# EAGLE board 1203_054 (EAGLE 7.1.0), part 1 of 3
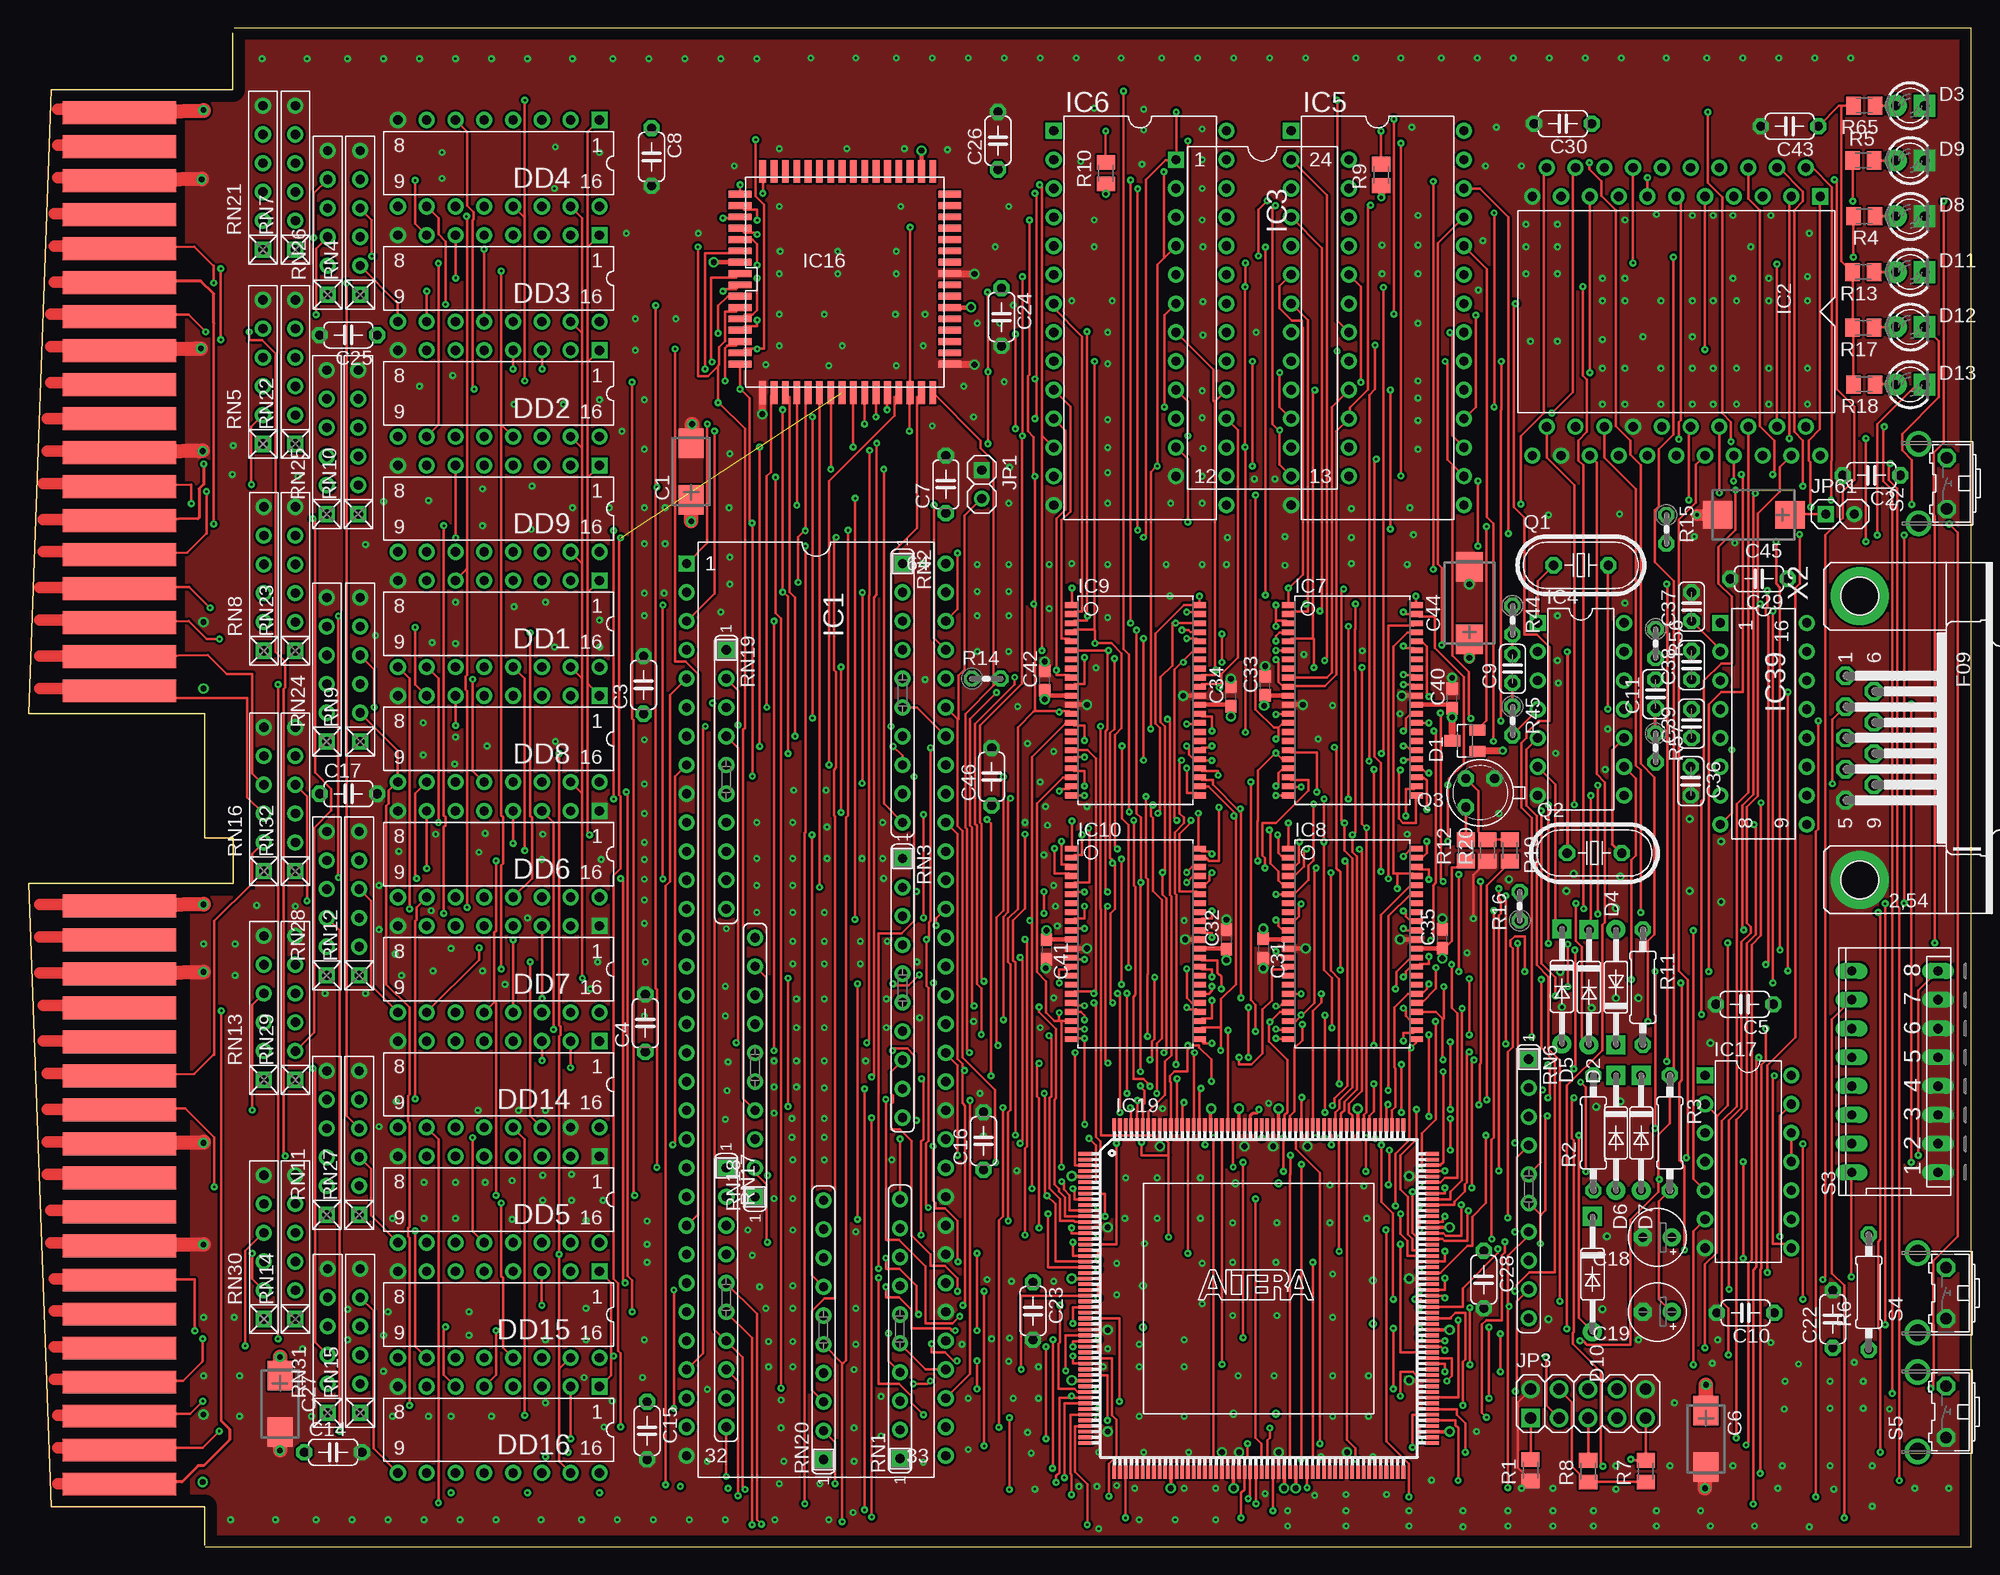
[diagram p3: board, top side]
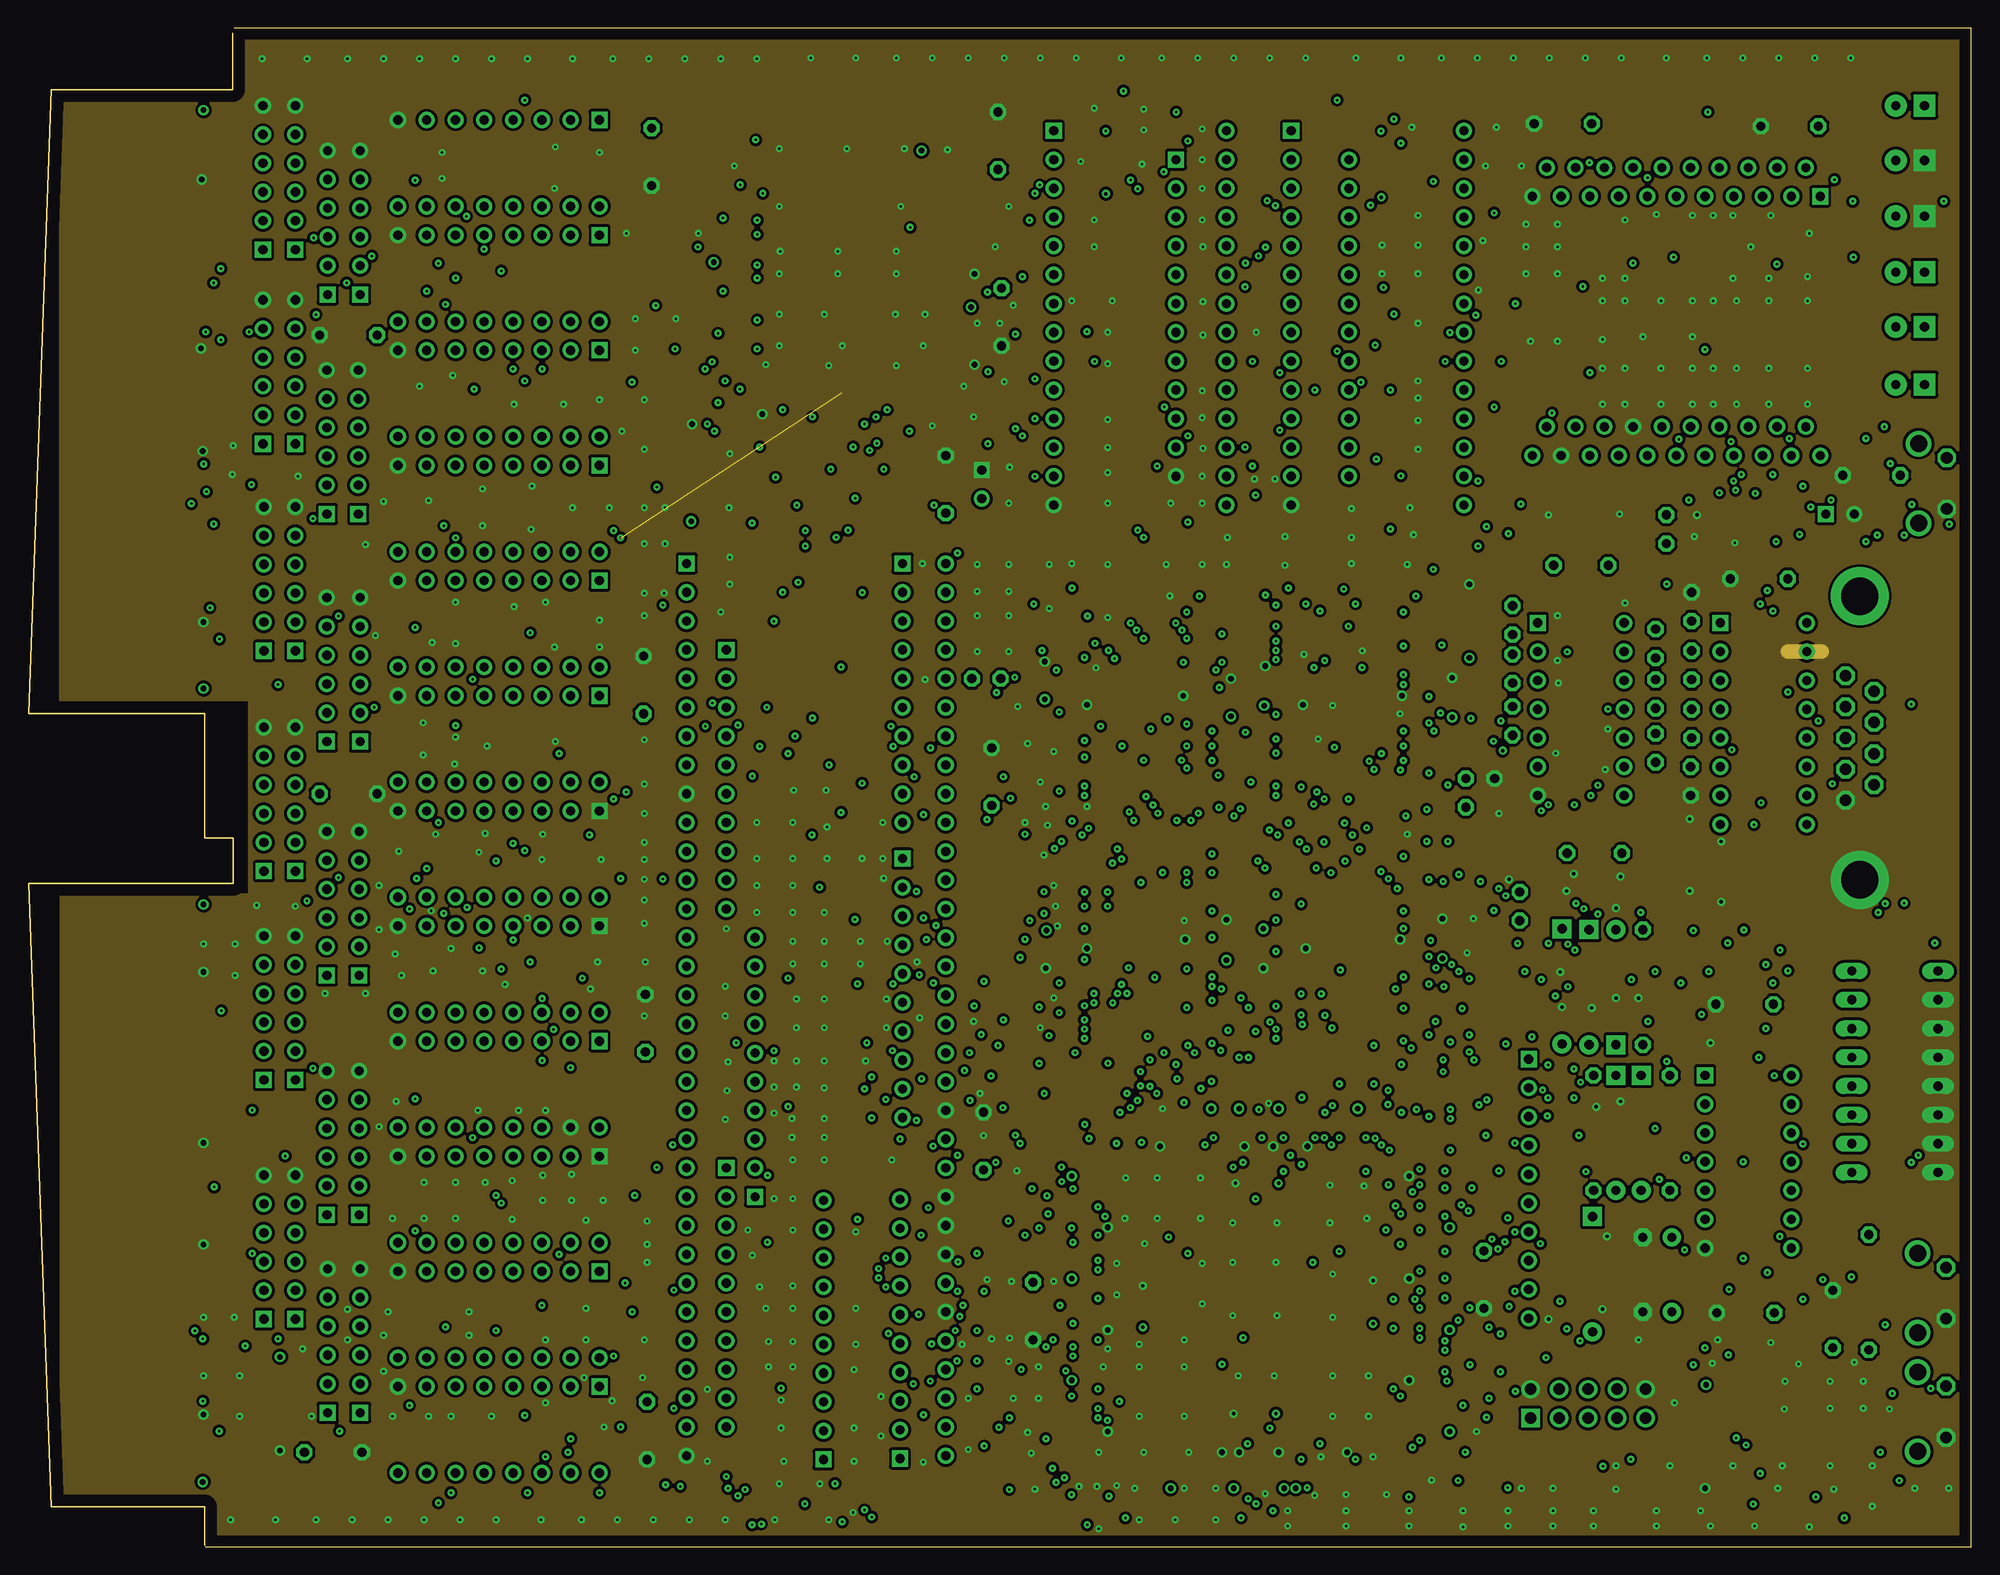
[diagram p4: board, inner layer Route2]
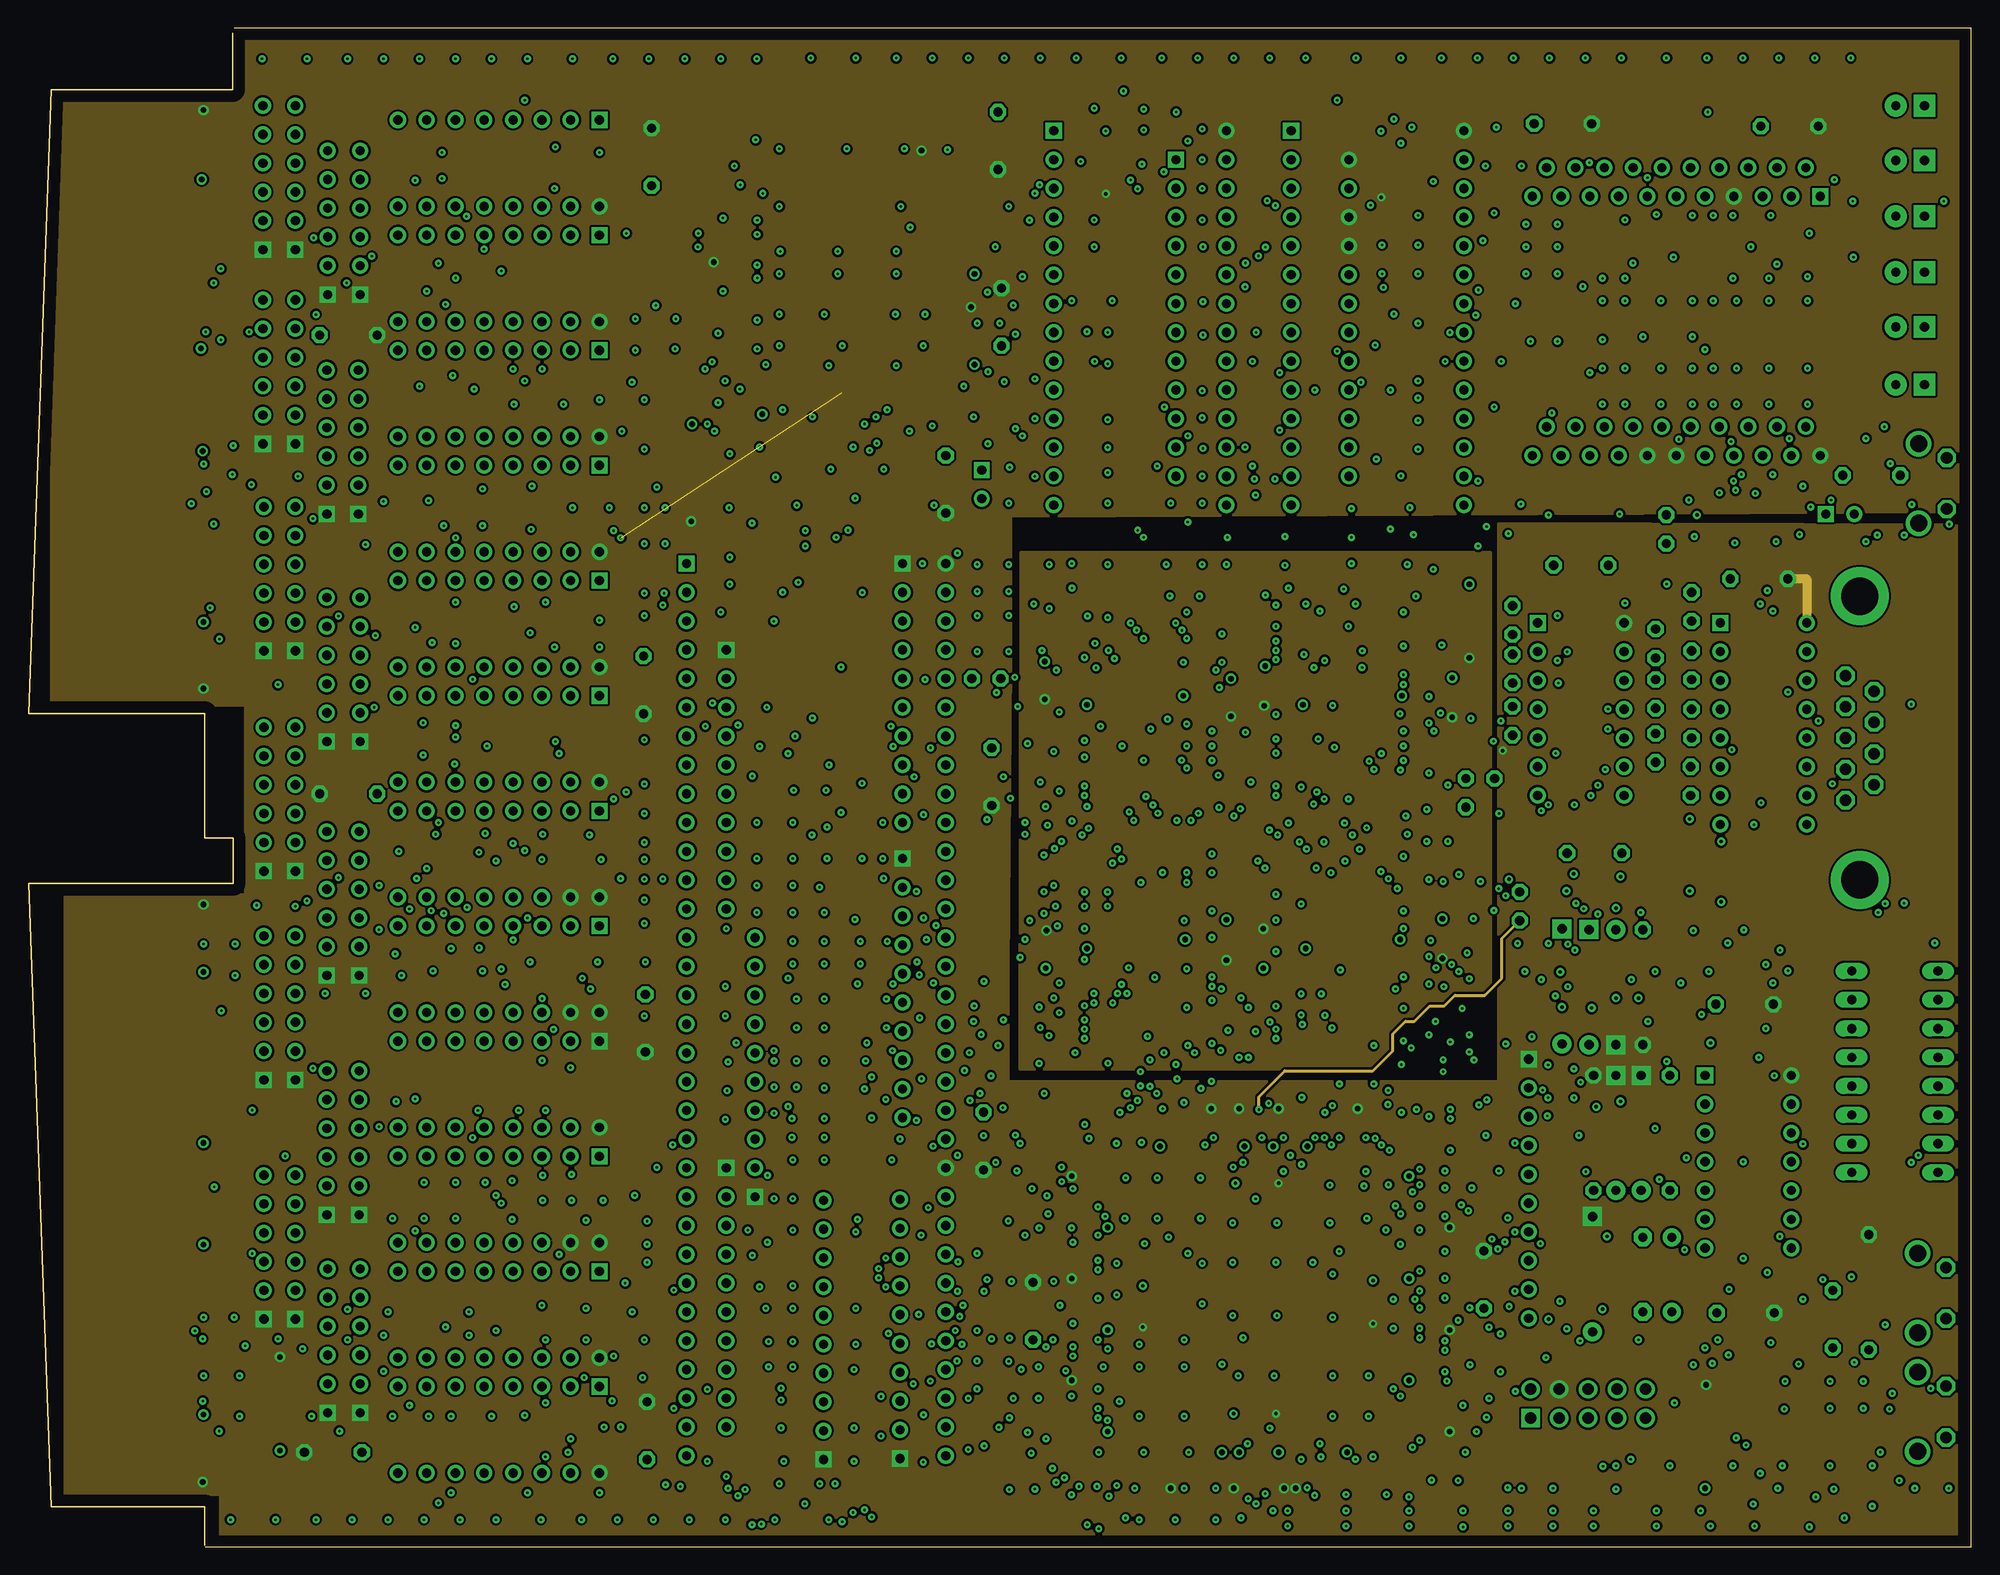
[diagram p5: board, inner layer Route3]
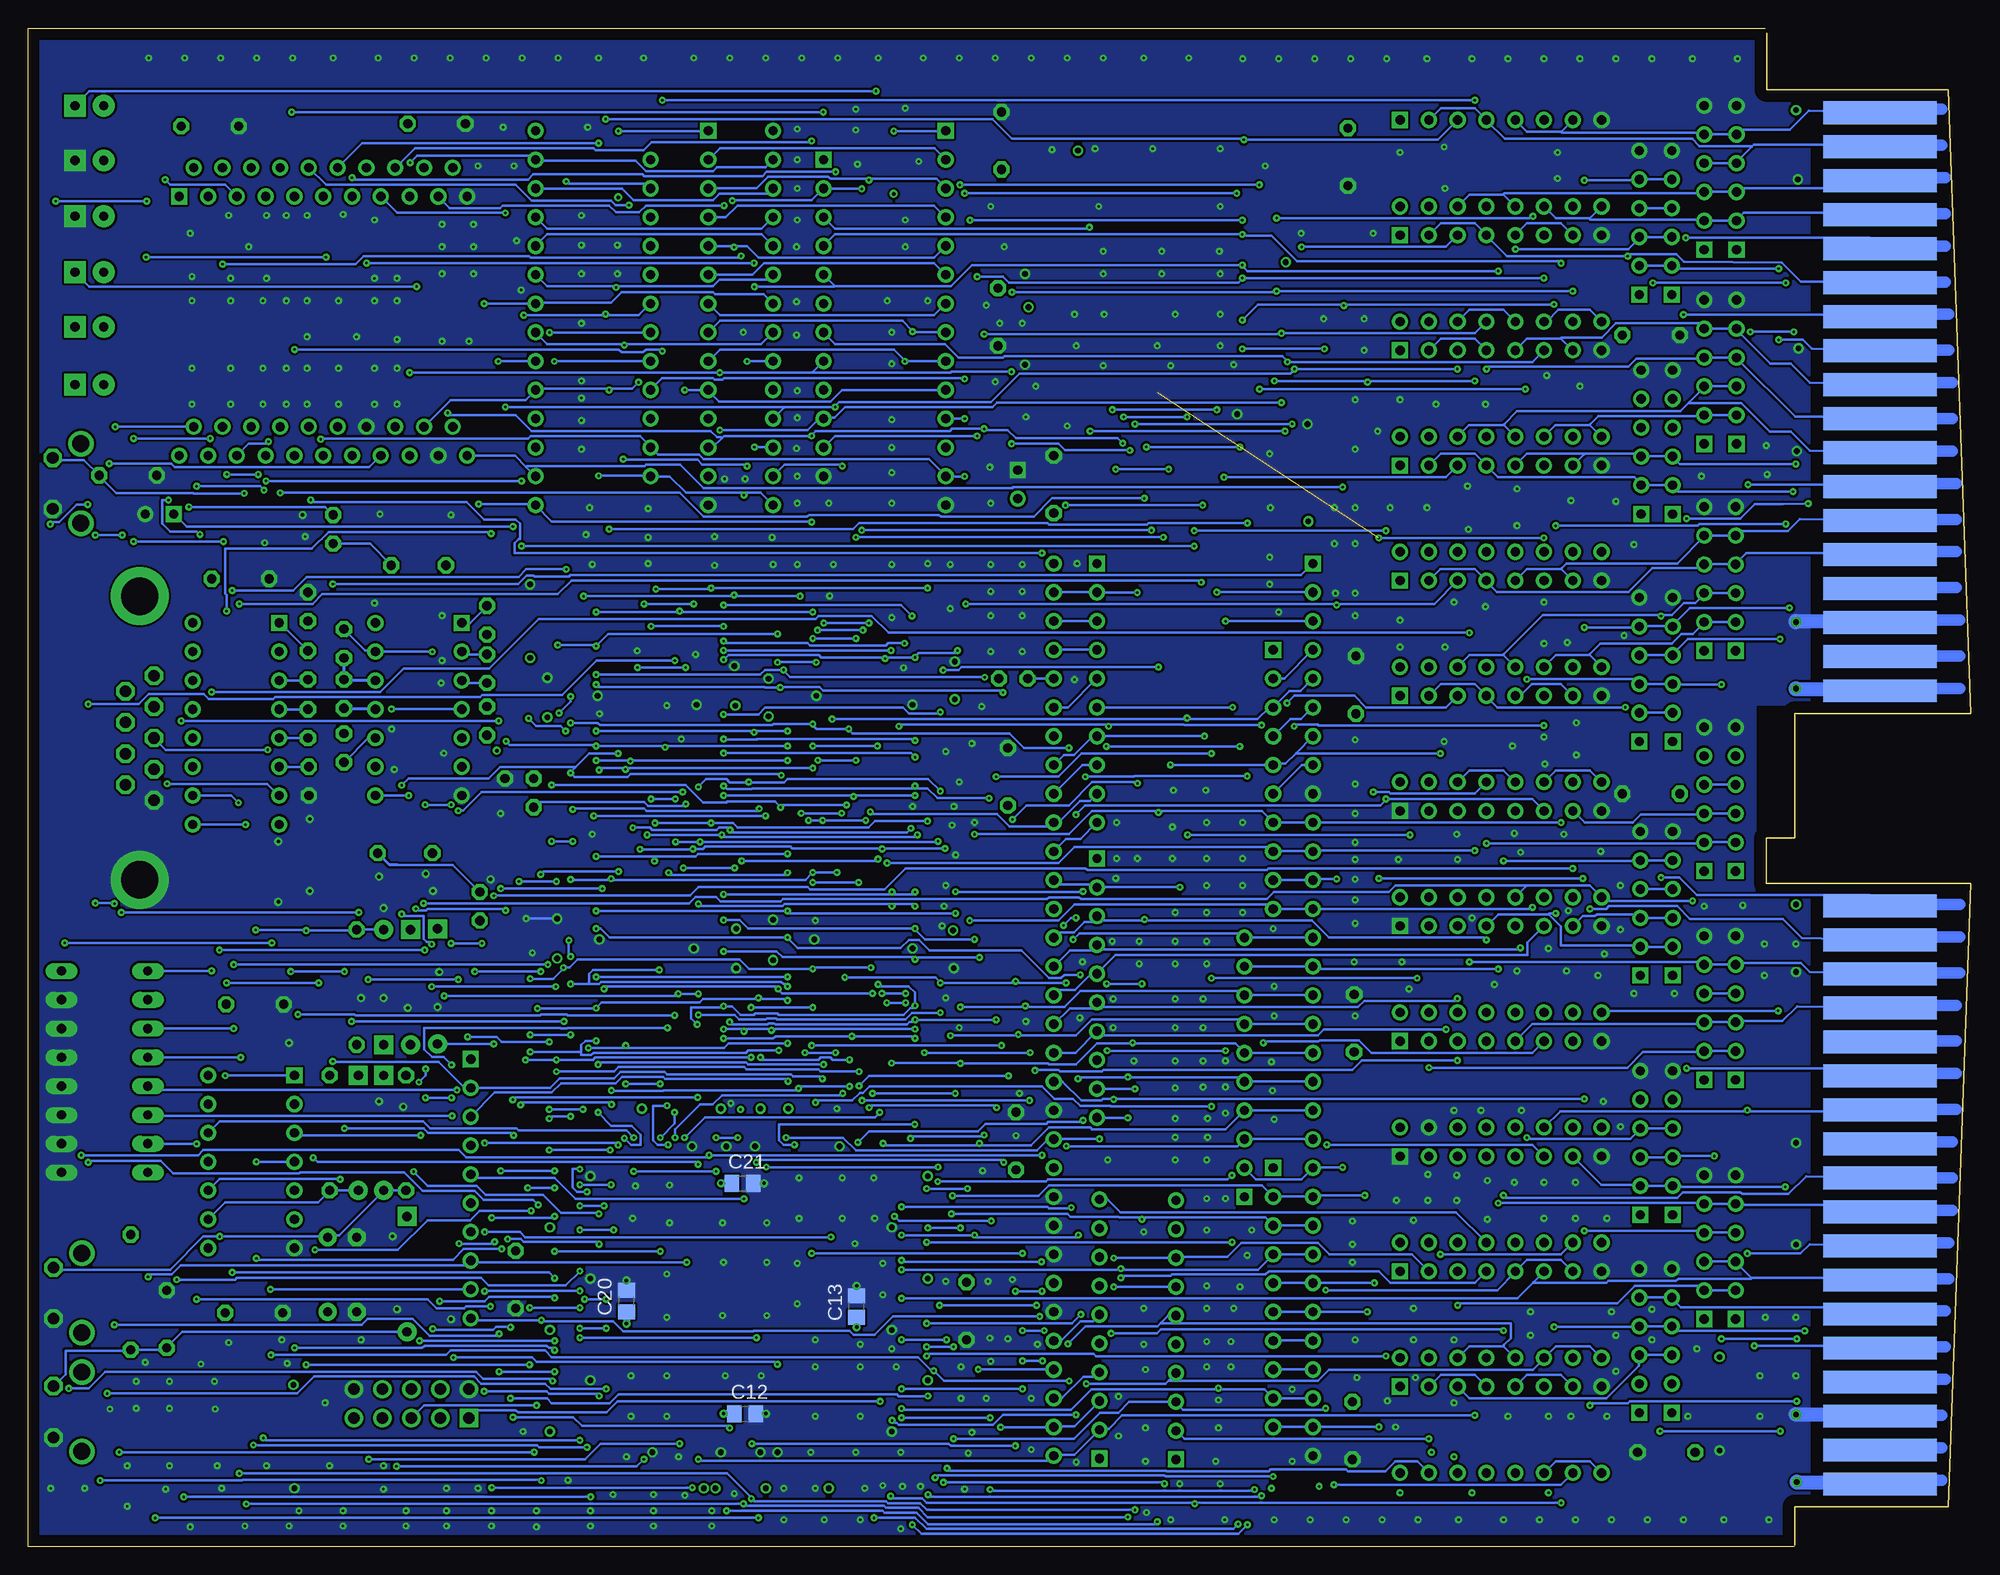
[diagram p6: board, bottom side, seen from below]

Size 171.38 x 133.97 mm. Coordinates in mm from the lower left corner, seen from the top.
Outline: 15.59,0 171.38,0 171.38,133.97 18.13,133.97
Copper layers (1+2*16): Top 0.035mm / dielectric 0.75mm / Route2 0.035mm / dielectric 0.75mm / Bottom 0.035mm
Design rules "default *": minimum track width 8mil, minimum drill 8mil, track to track 8mil, track to pad 8mil, pad to pad 8mil, via to via 8mil, smd to smd 8mil, copper to edge 40mil, drill to drill 8mil, minimum pad ring 12mil, minimum via ring 8mil, stop-mask expansion 0mil, vias tented up to drill 0mil, thermal gap 10mil

## Footprints (pad centres in the part's own frame; a part is rotated, then mirrored left to right if it is on the bottom)
CT6032 = smd 2.6 x 2.2: + -2.5,0; - 2.5,0
C050-024X044 = drill 0.813 octagon: 1 -2.54,0; 2 2.54,0
C025-024X044 = drill 0.813 octagon: 1 -1.27,0; 2 1.27,0
C0805 = smd 1.3 x 1.5: 1 -0.95,0; 2 0.95,0
E2,5-5 = drill 0.813 pad 1.6: + -1.27,0 | drill 0.813 pad 1.6 octagon: - 1.27,0
C0603 = smd 1.1 x 1: 1 -0.85,0; 2 0.85,0
CT7343 = smd 2.6 x 2.4: + -3.2,0; - 3.2,0
SOT23 = smd 1 x 1.4: 1 -0.95,-1.1; 2 0.95,-1.1; 3 0,1.1
DO35-10 = drill 0.813 pad 1.676: A 5.08,0 | drill 0.813 pad 1.676 square: K -5.08,0
LED3MM = drill 0.813 pad 1.93: A -1.27,0 | drill 0.813 pad 1.93 square: K 1.27,0
DIL16 = drill 0.813 square: 1 -8.89,-3.81 | drill 0.813: 2 -6.35,-3.81; 3 -3.81,-3.81; 4 -1.27,-3.81; 5 1.27,-3.81; 6 3.81,-3.81; 7 6.35,-3.81; 8 8.89,-3.81; 9 8.89,3.81; 10 6.35,3.81; 11 3.81,3.81; 12 1.27,3.81; 13 -1.27,3.81; 14 -3.81,3.81; 15 -6.35,3.81; 16 -8.89,3.81
DIL64 = drill 0.813 square: 1 -39.37,-11.43 | drill 0.813: 2 -36.83,-11.43; 3 -34.29,-11.43; 4 -31.75,-11.43; 5 -29.21,-11.43; 6 -26.67,-11.43; 7 -24.13,-11.43; 8 -21.59,-11.43; 9 -19.05,-11.43; 10 -16.51,-11.43; 11 -13.97,-11.43; 12 -11.43,-11.43; 13 -8.89,-11.43; 14 -6.35,-11.43; 15 -3.81,-11.43; 16 -1.27,-11.43; 17 1.27,-11.43; 18 3.81,-11.43; 19 6.35,-11.43; 20 8.89,-11.43; 21 11.43,-11.43; 22 13.97,-11.43; 23 16.51,-11.43; 24 19.05,-11.43; 25 21.59,-11.43; 26 24.13,-11.43; 27 26.67,-11.43; 28 29.21,-11.43; 29 31.75,-11.43; 30 34.29,-11.43; 31 36.83,-11.43; 32 39.37,-11.43; 33 39.37,11.43; 34 36.83,11.43; 35 34.29,11.43; 36 31.75,11.43; 37 29.21,11.43; 38 26.67,11.43; 39 24.13,11.43; 40 21.59,11.43; 41 19.05,11.43; 42 16.51,11.43; 43 13.97,11.43; 44 11.43,11.43; 45 8.89,11.43; 46 6.35,11.43; 47 3.81,11.43; 48 1.27,11.43; 49 -1.27,11.43; 50 -3.81,11.43; 51 -6.35,11.43; 52 -8.89,11.43; 53 -11.43,11.43; 54 -13.97,11.43; 55 -16.51,11.43; 56 -19.05,11.43; 57 -21.59,11.43; 58 -24.13,11.43; 59 -26.67,11.43; 60 -29.21,11.43; 61 -31.75,11.43; 62 -34.29,11.43; 63 -36.83,11.43; 64 -39.37,11.43
1801 = drill 0.813 square: 1 -10.16,12.7 | drill 0.813: 2 -12.7,11.43; 3 -10.16,10.16; 4 -12.7,8.89; 5 -10.16,7.62; 6 -12.7,6.35; 7 -10.16,5.08; 8 -12.7,3.81; 9 -10.16,2.54; 10 -12.7,1.27; 11 -10.16,0; 12 -12.7,-1.27; 13 -10.16,-2.54; 14 -12.7,-3.81; 15 -10.16,-5.08; 16 -12.7,-6.35; 17 -10.16,-7.62; 18 -12.7,-8.89; 19 -10.16,-10.16; 20 -12.7,-11.43; 21 -10.16,-12.7; 22 12.7,-12.7; 23 10.16,-11.43; 24 12.7,-10.16; 25 10.16,-8.89; 26 12.7,-7.62; 27 10.16,-6.35; 28 12.7,-5.08; 29 10.16,-3.81; 30 12.7,-2.54; 31 10.16,-1.27; 32 12.7,0; 33 10.16,1.27; 34 12.7,2.54; 35 10.16,3.81; 36 12.7,5.08; 37 10.16,6.35; 38 12.7,7.62; 39 10.16,8.89; 40 12.7,10.16; 41 10.16,11.43; 42 12.7,12.7
DIL24 = drill 0.813 square: 1 -13.97,-7.62 | drill 0.813: 2 -11.43,-7.62; 3 -8.89,-7.62; 4 -6.35,-7.62; 5 -3.81,-7.62; 6 -1.27,-7.62; 7 1.27,-7.62; 8 3.81,-7.62; 9 6.35,-7.62; 10 8.89,-7.62; 11 11.43,-7.62; 12 13.97,-7.62; 13 13.97,7.62; 14 11.43,7.62; 15 8.89,7.62; 16 6.35,7.62; 17 3.81,7.62; 18 1.27,7.62; 19 -1.27,7.62; 20 -3.81,7.62; 21 -6.35,7.62; 22 -8.89,7.62; 23 -11.43,7.62; 24 -13.97,7.62
DIL14 = drill 0.813 square: 1 -7.62,-3.81 | drill 0.813: 2 -5.08,-3.81; 3 -2.54,-3.81; 4 0,-3.81; 5 2.54,-3.81; 6 5.08,-3.81; 7 7.62,-3.81; 8 7.62,3.81; 9 5.08,3.81; 10 2.54,3.81; 11 0,3.81; 12 -2.54,3.81; 13 -5.08,3.81; 14 -7.62,3.81
DIL28 = drill 0.813 square: 1 -16.51,-7.62 | drill 0.813: 2 -13.97,-7.62; 3 -11.43,-7.62; 4 -8.89,-7.62; 5 -6.35,-7.62; 6 -3.81,-7.62; 7 -1.27,-7.62; 8 1.27,-7.62; 9 3.81,-7.62; 10 6.35,-7.62; 11 8.89,-7.62; 12 11.43,-7.62; 13 13.97,-7.62; 14 16.51,-7.62; 15 16.51,7.62; 16 13.97,7.62; 17 11.43,7.62; 18 8.89,7.62; 19 6.35,7.62; 20 3.81,7.62; 21 1.27,7.62; 22 -1.27,7.62; 23 -3.81,7.62; 24 -6.35,7.62; 25 -8.89,7.62; 26 -11.43,7.62; 27 -13.97,7.62; 28 -16.51,7.62
TSOP44 = smd 0.5 x 1.2: 1 -8.4,-5.627; 2 -7.6,-5.627; 3 -6.8,-5.627; 4 -6,-5.627; 5 -5.2,-5.627; 6 -4.4,-5.627; 7 -3.6,-5.627; 8 -2.8,-5.627; 9 -2,-5.627; 10 -1.2,-5.627; 11 -0.4,-5.627; 12 0.4,-5.627; 13 1.2,-5.627; 14 2,-5.627; 15 2.8,-5.627; 16 3.6,-5.627; 17 4.4,-5.627; 18 5.2,-5.627; 19 6,-5.627; 20 6.8,-5.627; 21 7.6,-5.627; 22 8.4,-5.627; 23 8.4,5.627; 24 7.6,5.627; 25 6.8,5.627; 26 6,5.627; 27 5.2,5.627; 28 4.4,5.627; 29 3.6,5.627; 30 2.8,5.627; 31 2,5.627; 32 1.2,5.627; 33 0.4,5.627; 34 -0.4,5.627; 35 -1.2,5.627; 36 -2,5.627; 37 -2.8,5.627; 38 -3.6,5.627; 39 -4.4,5.627; 40 -5.2,5.627; 41 -6,5.627; 42 -6.8,5.627; 43 -7.6,5.627; 44 -8.4,5.627
1801VM4 = smd 2 x 0.6: 1 -9.5,-0.5; 2 -9.5,-1.5; 3 -9.5,-2.5; 4 -9.5,-3.5; 5 -9.5,-4.5; 6 -9.5,-5.5; 7 -9.5,-6.5; 8 -9.5,-7.5; 25 9,-7.5; 26 9,-6.5; 27 9,-5.5; 28 9,-4.5; 29 9,-3.5; 30 9,-2.5; 31 9,-1.5; 32 9,-0.5; 33 9,0.5; 34 9,1.5; 35 9,2.5; 36 9,3.5; 37 9,4.5; 38 9,5.5; 39 9,6.5; 40 9,7.5; 57 -9.5,7.5; 58 -9.5,6.5; 59 -9.5,5.5; 60 -9.5,4.5; 61 -9.5,3.5; 62 -9.5,2.5; 63 -9.5,1.5; 64 -9.5,0.5 | smd 0.6 x 2: 9 -7.5,-10; 10 -6.5,-10; 11 -5.5,-10; 12 -4.5,-10; 13 -3.5,-10; 14 -2.5,-10; 15 -1.5,-10; 16 -0.5,-10; 17 0.5,-10; 18 1.5,-10; 19 2.5,-10; 20 3.5,-10; 21 4.5,-10; 22 5.5,-10; 23 6.5,-10; 24 7.5,-10; 41 7.5,9.5; 42 6.5,9.5; 43 5.5,9.5; 44 4.5,9.5; 45 3.5,9.5; 46 2.5,9.5; 47 1.5,9.5; 48 0.5,9.5; 49 -0.5,9.5; 50 -1.5,9.5; 51 -2.5,9.5; 52 -3.5,9.5; 53 -4.5,9.5; 54 -5.5,9.5; 55 -6.5,9.5; 56 -7.5,9.5
RQFP208 = smd 1.2 x 0.32: 1 -15.3,12.75; 2 -15.3,12.25; 3 -15.3,11.75; 4 -15.3,11.25; 5 -15.3,10.75; 6 -15.3,10.25; 7 -15.3,9.75; 8 -15.3,9.25; 9 -15.3,8.75; 10 -15.3,8.25; 11 -15.3,7.75; 12 -15.3,7.25; 13 -15.3,6.75; 14 -15.3,6.25; 15 -15.3,5.75; 16 -15.3,5.25; 17 -15.3,4.75; 18 -15.3,4.25; 19 -15.3,3.75; 20 -15.3,3.25; 21 -15.3,2.75; 22 -15.3,2.25; 23 -15.3,1.75; 24 -15.3,1.25; 25 -15.3,0.75; 26 -15.3,0.25; 27 -15.3,-0.25; 28 -15.3,-0.75; 29 -15.3,-1.25; 30 -15.3,-1.75; 31 -15.3,-2.25; 32 -15.3,-2.75; 33 -15.3,-3.25; 34 -15.3,-3.75; 35 -15.3,-4.25; 36 -15.3,-4.75; 37 -15.3,-5.25; 38 -15.3,-5.75; 39 -15.3,-6.25; 40 -15.3,-6.75; 41 -15.3,-7.25; 42 -15.3,-7.75; 43 -15.3,-8.25; 44 -15.3,-8.75; 45 -15.3,-9.25; 46 -15.3,-9.75; 47 -15.3,-10.25; 48 -15.3,-10.75; 49 -15.3,-11.25; 50 -15.3,-11.75; 51 -15.3,-12.25; 52 -15.3,-12.75; 105 15.3,-12.75; 106 15.3,-12.25; 107 15.3,-11.75; 108 15.3,-11.25; 109 15.3,-10.75; 110 15.3,-10.25; 111 15.3,-9.75; 112 15.3,-9.25; 113 15.3,-8.75; 114 15.3,-8.25; 115 15.3,-7.75; 116 15.3,-7.25; 117 15.3,-6.75; 118 15.3,-6.25; 119 15.3,-5.75; 120 15.3,-5.25; 121 15.3,-4.75; 122 15.3,-4.25; 123 15.3,-3.75; 124 15.3,-3.25; 125 15.3,-2.75; 126 15.3,-2.25; 127 15.3,-1.75; 128 15.3,-1.25; 129 15.3,-0.75; 130 15.3,-0.25; 131 15.3,0.25; 132 15.3,0.75; 133 15.3,1.25; 134 15.3,1.75; 135 15.3,2.25; 136 15.3,2.75; 137 15.3,3.25; 138 15.3,3.75; 139 15.3,4.25; 140 15.3,4.75; 141 15.3,5.25; 142 15.3,5.75; 143 15.3,6.25; 144 15.3,6.75; 145 15.3,7.25; 146 15.3,7.75; 147 15.3,8.25; 148 15.3,8.75; 149 15.3,9.25; 150 15.3,9.75; 151 15.3,10.25; 152 15.3,10.75; 153 15.3,11.25; 154 15.3,11.75; 155 15.3,12.25; 156 15.3,12.75 | smd 0.32 x 1.2: 53 -12.75,-15.3; 54 -12.25,-15.3; 55 -11.75,-15.3; 56 -11.25,-15.3; 57 -10.75,-15.3; 58 -10.25,-15.3; 59 -9.75,-15.3; 60 -9.25,-15.3; 61 -8.75,-15.3; 62 -8.25,-15.3; 63 -7.75,-15.3; 64 -7.25,-15.3; 65 -6.75,-15.3; 66 -6.25,-15.3; 67 -5.75,-15.3; 68 -5.25,-15.3; 69 -4.75,-15.3; 70 -4.25,-15.3; 71 -3.75,-15.3; 72 -3.25,-15.3; 73 -2.75,-15.3; 74 -2.25,-15.3; 75 -1.75,-15.3; 76 -1.25,-15.3; 77 -0.75,-15.3; 78 -0.25,-15.3; 79 0.25,-15.3; 80 0.75,-15.3; 81 1.25,-15.3; 82 1.75,-15.3; 83 2.25,-15.3; 84 2.75,-15.3; 85 3.25,-15.3; 86 3.75,-15.3; 87 4.25,-15.3; 88 4.75,-15.3; 89 5.25,-15.3; 90 5.75,-15.3; 91 6.25,-15.3; 92 6.75,-15.3; 93 7.25,-15.3; 94 7.75,-15.3; 95 8.25,-15.3; 96 8.75,-15.3; 97 9.25,-15.3; 98 9.75,-15.3; 99 10.25,-15.3; 100 10.75,-15.3; 101 11.25,-15.3; 102 11.75,-15.3; 103 12.25,-15.3; 104 12.75,-15.3; 157 12.75,15.3; 158 12.25,15.3; 159 11.75,15.3; 160 11.25,15.3; 161 10.75,15.3; 162 10.25,15.3; 163 9.75,15.3; 164 9.25,15.3; 165 8.75,15.3; 166 8.25,15.3; 167 7.75,15.3; 168 7.25,15.3; 169 6.75,15.3; 170 6.25,15.3; 171 5.75,15.3; 172 5.25,15.3; 173 4.75,15.3; 174 4.25,15.3; 175 3.75,15.3; 176 3.25,15.3; 177 2.75,15.3; 178 2.25,15.3; 179 1.75,15.3; 180 1.25,15.3; 181 0.75,15.3; 182 0.25,15.3; 183 -0.25,15.3; 184 -0.75,15.3; 185 -1.25,15.3; 186 -1.75,15.3; 187 -2.25,15.3; 188 -2.75,15.3; 189 -3.25,15.3; 190 -3.75,15.3; 191 -4.25,15.3; 192 -4.75,15.3; 193 -5.25,15.3; 194 -5.75,15.3; 195 -6.25,15.3; 196 -6.75,15.3; 197 -7.25,15.3; 198 -7.75,15.3; 199 -8.25,15.3; 200 -8.75,15.3; 201 -9.25,15.3; 202 -9.75,15.3; 203 -10.25,15.3; 204 -10.75,15.3; 205 -11.25,15.3; 206 -11.75,15.3; 207 -12.25,15.3; 208 -12.75,15.3
1X02 = drill 0.8 square: 1 -1.27,0 | drill 0.8: 2 1.27,0
2X05 = drill 1.016 square: 1 -5.08,-1.27 | drill 1.016: 2 -5.08,1.27; 3 -2.54,-1.27; 4 -2.54,1.27; 5 0,-1.27; 6 0,1.27; 7 2.54,-1.27; 8 2.54,1.27; 9 5.08,-1.27; 10 5.08,1.27
HC49U70 = drill 0.813 octagon: 1 -2.413,0; 2 2.413,0
TO18 = drill 0.813 octagon: 1 -1.27,-1.27; 2 1.27,-1.27; 3 1.27,1.27
M0805 = smd 1.3 x 1.6: 1 -0.95,0; 2 0.95,0
0207/10 = drill 0.813 octagon: 1 -5.08,0; 2 5.08,0
0204V = drill 0.813 octagon: 1 -1.27,0; 2 1.27,0
SIL10 = drill 0.813 square: 1 -11.43,0 | drill 0.813: 2 -8.89,0; 3 -6.35,0; 4 -3.81,0; 5 -1.27,0; 6 1.27,0; 7 3.81,0; 8 6.35,0; 9 8.89,0; 10 11.43,0
RN-6 = drill 0.813 square: 1 -6.35,0 | drill 0.813: 2 -3.81,0; 3 -1.27,0; 4 1.27,0; 5 3.81,0; 6 6.35,0
B3F-31XX = drill 1.016 octagon: 1 -2.261,-1.245; 2 2.261,-1.245 | drill 1.499 pad 2.159: 3 -3.505,1.245; 4 3.505,1.245
DP-08 = drill 0.813 long: 1 -8.89,-3.81; 2 -6.35,-3.81; 3 -3.81,-3.81; 4 -1.27,-3.81; 5 1.27,-3.81; 6 3.81,-3.81; 7 6.35,-3.81; 8 8.89,-3.81; 9 8.89,3.81; 10 6.35,3.81; 11 3.81,3.81; 12 1.27,3.81; 13 -1.27,3.81; 14 -3.81,3.81; 15 -6.35,3.81; 16 -8.89,3.81
F09HP = drill 1.016 octagon: 1 -5.486,-1.27; 2 -2.743,-1.27; 3 0,-1.27; 4 2.743,-1.27; 5 5.486,-1.27; 6 -4.115,1.27; 7 -1.372,1.27; 8 1.372,1.27; 9 4.115,1.27 | drill 3.302 pad 5.08: G1 -12.522,0; G2 12.522,0
CON1 = smd 2 x 10: AA1 -57.008,7.74; AA2 -54.008,7.74; AA3 -51.008,7.74; AA4 -48.008,7.74; AA5 -45.008,7.74; AA6 -42.008,7.74; AA7 -39.008,7.74; AA8 -36.008,7.74; AA9 -33.008,7.74; AA10 -30.008,7.74; AA11 -27.008,7.74; AA12 -24.008,7.74; AA13 -21.008,7.74; AA14 -18.008,7.74; AA15 -15.008,7.74; AA16 -12.008,7.74; AA17 -9.008,7.74; AA18 -6.008,7.74; BA1 12.992,7.74; BA2 15.992,7.74; BA3 18.992,7.74; BA4 21.992,7.74; BA5 24.992,7.74; BA6 27.992,7.74; BA7 30.992,7.74; BA8 33.992,7.74; BA9 36.992,7.74; BA10 39.992,7.74; BA11 42.992,7.74; BA12 45.992,7.74; BA13 48.992,7.74; BA14 51.992,7.74; BA15 54.992,7.74; BA16 57.992,7.74; BA17 60.992,7.74; BA18 63.992,7.74 | smd 2 x 10 bottom: AB1 -57.008,7.74; AB2 -54.008,7.74; AB3 -51.008,7.74; AB4 -48.008,7.74; AB5 -45.008,7.74; AB6 -42.008,7.74; AB7 -39.008,7.74; AB8 -36.008,7.74; AB9 -33.008,7.74; AB10 -30.008,7.74; AB11 -27.008,7.74; AB12 -24.008,7.74; AB13 -21.008,7.74; AB14 -18.008,7.74; AB15 -15.008,7.74; AB16 -12.008,7.74; AB17 -9.008,7.74; AB18 -6.008,7.74; BB1 12.992,7.74; BB2 15.992,7.74; BB3 18.992,7.74; BB4 21.992,7.74; BB5 24.992,7.74; BB6 27.992,7.74; BB7 30.992,7.74; BB8 33.992,7.74; BB9 36.992,7.74; BB10 39.992,7.74; BB11 42.992,7.74; BB12 45.992,7.74; BB13 48.992,7.74; BB14 51.992,7.74; BB15 54.992,7.74; BB16 57.992,7.74; BB17 60.992,7.74; BB18 63.992,7.74

## Placement (x,y rotation side)
C1  [CT6032]  58.44,94.85 90 top
C2  100n  [C050-024X044]  162.58,94.53 180 top
C3  [C050-024X044]  54.24,76.03 90 top
C4  [C050-024X044]  54.4,46.19 90 top
C5  [C050-024X044]  151.39,47.86 180 top
C6  [CT6032]  147.98,9.52 270 top
C7  [C050-024X044]  80.91,93.74 90 top
C8  [C050-024X044]  54.95,122.63 270 top
C9  100  [C025-024X044]  130.91,77.46 90 top
C10  [C050-024X044]  151.47,20.63 180 top
C11  100  [C025-024X044]  143.53,75.24 90 top
C12  [C0805]  108.13,11.74 0 bottom
C13  [C0805]  98.29,21.19 90 bottom
C14  [C050-024X044]  26.85,8.33 0 top
C15  [C050-024X044]  54.55,10.23 270 top
C16  [C050-024X044]  84.24,35.79 90 top
C17  [C050-024X044]  28.2,66.43 0 top
C18  47x25  [E2,5-5]  143.69,27.3 180 top
C19  47x25  [E2,5-5]  143.69,20.71 180 top
C20  [C0805]  118.61,21.66 90 bottom
C21  [C0805]  108.37,32.06 0 bottom
C22  100n  [C050-024X044]  159.17,20.08 90 top
C23  [C050-024X044]  88.61,20.79 270 top
C24  [C050-024X044]  85.83,108.5 270 top
C25  [C050-024X044]  28.2,106.91 180 top
C26  [C050-024X044]  85.51,124.06 90 top
C27  [CT6032]  22.17,12.61 270 top
C28  [C050-024X044]  128.37,23.57 270 top
C29  [C050-024X044]  152.66,85.4 180 top
C30  [C050-024X044]  135.36,125.56 180 top
C31  [C0603]  108.93,52.78 270 top
C32  [C0603]  105.67,53.57 90 top
C33  [C0603]  109.09,75.96 90 top
C34  [C0603]  106.07,75 90 top
C35  [C0603]  124.72,53.65 90 top
C36  100n  [C025-024X044]  146.63,67.54 270 top
C37  100n  [C025-024X044]  146.71,82.94 90 top
C38  100n  [C025-024X044]  146.71,77.78 90 top
C39  100n  [C025-024X044]  146.71,72.62 90 top
C40  [C0603]  125.6,74.84 90 top
C41  [C0603]  89.8,52.7 270 top
C42  [C0603]  89.64,76.43 90 top
C43  [C050-024X044]  155.36,125.33 180 top
C44  [CT7343]  127.1,83.26 90 top
C45  [CT7343]  152.19,91.04 180 top
C46  [C050-024X044]  84.95,67.94 90 top
D1  BAS70  [SOT23]  126.71,71.11 90 top
D2  1N4148  [DO35-10]  137.66,49.36 270 top
D3  LED3MM  [LED3MM]  166,127.15 0 top
D4  1N4148  [DO35-10]  140.04,49.36 90 top
D5  1N4148  [DO35-10]  135.28,49.44 270 top
D6  1N4148  [DO35-10]  140.04,36.51 270 top
D7  1N4148  [DO35-10]  142.26,36.51 270 top
D8  LED3MM  [LED3MM]  166,117.39 0 top
D9  LED3MM  [LED3MM]  166,122.31 0 top
D10  1N4148  [DO35-10]  137.98,24.04 270 top
D11  LED3MM  [LED3MM]  166,112.47 0 top
D12  LED3MM  [LED3MM]  166,107.63 0 top
D13  LED3MM  [LED3MM]  166,102.55 0 top
DD1  531AP2  [DIL16]  41.46,81.43 180 top
DD2  531AP2  [DIL16]  41.46,101.75 180 top
DD3  531AP2  [DIL16]  41.46,111.91 180 top
DD4  531AP2  [DIL16]  41.46,122.07 180 top
DD5  531AP2  [DIL16]  41.46,30.63 180 top
DD6  531AP2  [DIL16]  41.46,61.11 180 top
DD7  531AP2  [DIL16]  41.46,50.95 180 top
DD8  531AP2  [DIL16]  41.46,71.27 180 top
DD9  531AP2  [DIL16]  41.46,91.59 180 top
DD14  531AP2  [DIL16]  41.46,40.79 180 top
DD15  531AP2  [DIL16]  41.46,20.47 180 top
DD16  531AP2  [DIL16]  41.46,10.31 180 top
IC1  1801VM03  [DIL64]  69.48,47.38 270 top
IC2  [1801]  145.36,108.98 270 top
IC3  1801RE2-134  [DIL24]  108.85,108.42 270 top
IC4  74AHC04N  [DIL14]  136.95,73.89 270 top
IC5  27256-1  [DIL28]  119.01,108.42 270 top
IC6  27256-0  [DIL28]  98.05,108.42 270 top
IC7  [TSOP44]  116.78,74.69 270 top
IC8  [TSOP44]  116.78,53.17 270 top
IC9  [TSOP44]  97.66,74.69 270 top
IC10  [TSOP44]  97.66,53.17 270 top
IC16  1801VM4  [1801VM4]  72.26,111.83 0 top
IC17  74HC14N  [DIL14]  151.71,33.97 270 top
IC19  EPM7256-Q208  [RQFP208]  108.53,21.9 0 top
IC39  MAX232  [DIL16]  153.06,72.62 270 top
JP1  [1X02]  84.08,93.74 270 top
JP3  [2X05]  137.58,12.61 0 top
JP61  [1X02]  159.81,91.12 0 top
Q1  [HC49U70]  136.95,86.59 0 top
Q2  24M  [HC49U70]  138.14,61.19 0 top
Q3  2N2222  [TO18]  128.06,66.51 180 top
R1  4k7  [M0805]  132.5,6.74 90 top
R2  2k2  [0207/10]  138.06,36.51 90 top
R3  2k2  [0207/10]  144.8,36.51 270 top
R4  560  [M0805]  161.95,117.39 180 top
R5  560  [M0805]  161.87,122.31 0 top
R6  10k  [0207/10]  162.35,22.46 90 top
R7  4k7  [M0805]  142.66,6.66 90 top
R8  4k7  [M0805]  137.58,6.66 90 top
R9  1k  [M0805]  119.32,121.04 90 top
R10  1k  [M0805]  95.04,121.2 90 top
R11  10k  [0207/10]  142.42,49.36 270 top
R12  [M0805]  126.79,61.43 90 top
R13  560  [M0805]  161.87,112.47 180 top
R14  22  [0204V]  84.48,76.59 0 top
R15  [0204V]  144.49,89.77 270 top
R16  [0204V]  131.55,56.51 90 top
R17  560  [M0805]  161.87,107.55 180 top
R18  560  [M0805]  161.95,102.55 180 top
R19  [M0805]  130.67,61.43 270 top
R20  [M0805]  128.69,61.43 90 top
R44  560  [0204V]  130.91,81.75 270 top
R45  560  [0204V]  130.91,72.86 270 top
R56  560  [0204V]  143.53,79.69 270 top
R57  560  [0204V]  143.53,70.48 270 top
R65  560  [M0805]  161.95,127.15 180 top
RN1  2k2  [SIL10]  76.86,19.2 90 top
RN2  2k2  [SIL10]  77.1,75.32 270 top
RN3  2k2  [SIL10]  77.1,49.29 270 top
RN4  [RN-6]  29.23,116.83 90 top
RN5  [RN-6]  20.66,103.66 90 top
RN6  2k2  [SIL10]  132.34,31.58 270 top
RN7  [RN-6]  23.52,120.8 90 top
RN8  [RN-6]  20.74,85.4 90 top
RN9  [RN-6]  29.23,77.38 90 top
RN10  [RN-6]  29.08,97.47 90 top
RN11  [RN-6]  26.3,35.63 90 top
RN12  [RN-6]  29.15,56.75 90 top
RN13  [RN-6]  20.74,47.54 90 top
RN14  [RN-6]  23.52,26.43 90 top
RN15  [RN-6]  29.23,18.17 90 top
RN16  [RN-6]  20.74,65.95 90 top
RN17  2k2  [SIL10]  61.54,21.98 270 top
RN18  2k2  [SIL10]  64.08,42.3 90 top
RN19  2k2  [SIL10]  61.54,67.7 270 top
RN20  2k2  [SIL10]  70.11,19.12 90 top
RN21  [RN-6]  20.66,120.8 90 top
RN22  [RN-6]  23.52,103.66 90 top
RN23  [RN-6]  23.52,85.4 90 top
RN24  [RN-6]  26.3,77.38 90 top
RN25  [RN-6]  26.3,97.47 90 top
RN26  [RN-6]  26.38,116.83 90 top
RN27  [RN-6]  29.15,35.63 90 top
RN28  [RN-6]  26.3,56.75 90 top
RN29  [RN-6]  23.52,47.54 90 top
RN30  [RN-6]  20.74,26.43 90 top
RN31  [RN-6]  26.38,18.17 90 top
RN32  [RN-6]  23.52,65.95 90 top
S2  [B3F-31XX]  167.98,93.81 90 top
S3  [DP-08]  164.65,41.9 90 top
S4  [B3F-31XX]  167.9,22.38 90 top
S5  [B3F-31XX]  167.9,11.9 90 top
X2  [F09HP]  161.55,71.35 270 top
XP1  [CON1]  15.74,62.54 90 top

## Tracks (layer width: path | path; a pad name or v marks a point on that pad's centre or on a via)
1D1  (via drill 0.2)
  Top 0.203: v102.27,25.89 102.27,37.19 IC19.195 | v83.67,19.06 v83.67,25.89 | v81.74,19.06 81.47,19.06 81.27,19.26 77.89,19.26 77.89,20.89 76.79,21.99 75.62,21.99 v75.62,22.91 | 49.38,76.05 49.32,76.11 49.32,84.21 49.38,84.27 | 49.38,76.05 DD8.1 | 49.38,84.27 DD1.1 | 49.38,94.42 49.32,94.36 49.32,84.34 49.38,84.27 | 49.38,94.42 50.34,95.39 DD9.1 | 49.38,104.6 49.32,104.54 49.32,94.49 49.38,94.42 | 49.38,104.6 DD2.1 | 49.38,114.75 49.32,114.69 49.32,104.66 49.38,104.6 | 49.38,114.75 DD3.1 | DD4.1 50.34,125.86 49.32,124.84 49.32,114.81 49.38,114.75 | v69.09,62.81 69.09,23.94 70.09,22.94 RN20.7 | v49.47,62.81 49.32,62.96 49.32,75.99 49.38,76.05
  Bottom 0.203: v83.67,25.89 v102.27,25.89 | v81.74,19.06 v83.67,19.06 | v75.62,22.91 70.12,22.91 RN20.7 | v49.47,62.81 v69.09,62.81
15D1  (via drill 0.2)
  Top 0.203: v101.92,39.19 101.79,39.06 101.79,37.21 IC19.196 | v66.99,50.16 v66.99,38.84 | v48.84,50.16 48.84,66.44 48.78,66.5 | 48.78,66.5 DD8.15 | 48.78,76.65 48.84,76.59 48.84,66.56 48.78,66.5 | 48.78,76.65 DD1.15 | 48.78,86.8 48.84,86.74 48.84,76.71 48.78,76.65 | 48.78,86.8 47.82,87.76 DD9.15 | 48.78,96.97 48.84,96.91 48.84,86.86 48.78,86.8 | 48.78,96.97 DD2.15 | 48.78,107.13 48.84,107.06 48.84,97.04 48.78,96.97 | 48.78,107.13 47.82,108.09 DD3.15 | DD4.15 48.84,117.24 48.84,107.19 48.78,107.13
  Bottom 0.203: v101.92,39.19 101.74,39.36 98.69,39.36 98.02,40.04 97.72,40.04 97.14,40.61 81.94,40.61 80.84,39.51 79.19,39.51 78.57,38.89 75.92,38.89 75.87,38.84 v66.99,38.84 | v48.84,50.16 v66.99,50.16
50HZ  (via drill 0.2)
  Top 0.203: v124.94,23.69 124.94,22.66 123.84,22.66 IC19.132 | v153.39,24.19 153.39,42.46 155.84,44.91 155.84,84.59 156.24,84.99 v156.24,89.31 | v159.02,92.34 159.02,95.79 159.09,95.86 159.09,119.96 157.39,121.66 IC2.2
  Bottom 0.203: v124.94,23.69 125.44,24.19 v153.39,24.19 | v156.24,89.31 156.52,89.59 158.87,89.59 159.57,90.29 159.57,92.34 v159.02,92.34
4608M  (via drill 0.2)
  Top 0.203: v157.22,91.74 157.17,91.79 157.17,95.71 157.04,95.84 157.04,97.61 158.04,98.61 158.04,119.11 IC2.1
  Bottom 0.203: v157.22,91.74 145.19,91.74 R15.1
4608MM
  Top 0.203: IC4.10 139.72,70.31 139.72,61.96
  Top 0.254: 139.72,61.96 140.55,61.16 Q2.2
  Bottom 0.203: R57.2 143.52,69.21 141.39,71.34 140.77,71.34 IC4.10 | 138.8,60.16 133.94,60.16 131.57,57.79 R16.2
  Bottom 0.254: 138.8,60.16 139.52,60.16 Q2.2
+3V3  (via drill 0.5)
  Top 0.203: R12.1 126.77,60.46 126.24,59.94 125.54,59.94 125.54,53.46 125.02,52.94 C35.1
  Top 0.406: IC9.11 89.64,75.09 C42.1 | IC9.33 106.07,74.29 C34.1 | IC7.11 109.09,75.09 C33.1 | IC7.33 125.6,74.29 C40.1 | IC10.11 89.8,53.57 C41.1 | IC10.33 105.67,52.78 C32.1 | IC8.11 108.93,53.57 C31.1 | IC8.33 124.72,52.78 C35.1
  Top 0.61: C42.1 v89.64,74.77 | C34.1 v106.07,73.26 | C33.1 109.01,75.11 v109.01,74.21 | C40.1 v125.6,73.18 D1.3 | C35.1 v124.72,51.9 | C31.1 v108.93,54.52 | C32.1 v105.67,51.75 | C41.1 v89.8,54.37
  Top 1.016: C44.+ v127.1,78.42
  pour Route3 (no thermals): 87.5,87.7 87.42,42.14 129.01,42.14 129.01,87.7
+5V  (via drill 0.3, 0.5)
  Top 0.203: R18.2 160.99,102.56 160.99,107.49 R17.2 160.94,107.56 160.94,112.46 R13.2 160.84,112.54 159.94,113.44 159.94,127.14 | 106.78,38.64 106.79,38.64 v106.78,38.65 | v110.28,38.65 110.29,38.66 v110.28,38.65 | 159.94,127.14 160.99,127.14 R65.2 | 159.94,127.14 159.72,127.14 157.92,125.34 C43.1 | JP3.4 135.04,13.86 136.17,12.74 136.17,7.11 R8.1 137.67,5.71 142.64,5.71 R7.1
  Top 0.305: IC19.191 104.28,38.65 v104.32,38.65 | IC19.186 106.78,38.64 v106.78,38.65 106.78,38.33 | IC19.179 v110.28,38.65 110.28,38.33 | IC19.165 117.28,38.65 v117.26,38.65 | IC19.143 123.83,28.17 v125.36,28.17 | IC19.125 125.36,19.15 v125.36,19.12 | IC19.107 124.96,10.15 v125.36,10.15 | IC19.85 v111.78,5.15 | IC19.83 110.78,5.15 v110.75,5.15 | IC19.74 106.28,5.15 v106.31,5.15 | IC19.63 100.78,5.15 v100.75,5.15 | IC19.41 92.02,14.65 v92.02,14.68 | IC19.23 v92.02,23.65 | IC19.5 92.02,32.65 v92.02,32.7
  Top 0.406: IC16.63 v60.43,113.33 v60.43,113.34 | IC16.30 83.13,109.33 v83.13,109.37 | IC16.42 v78.76,123.18
  Top 0.61: D1.1 127.81,70.24 v130.04,70.24 | R10.1 v95.04,119.37 | R9.1 v119.32,119.06
  Top 1.27: XP1.BA18 15.42,126.69 v15.42,126.76 | XP1.AA18 15.42,56.69 v15.42,56.67 | C27.+ v22.17,16.74 | C6.+ v147.98,14.28 | C1.+ v58.44,90.48
  Route3 0.813: C29.1 156.87,85.4 156.87,81.51
  Bottom 0.61: C21.1 v110.28,32.06 | C20.1 v118.61,19.68 | C12.1 v110.04,11.74 | C13.1 v98.29,19.36
  Bottom 1.27: XP1.BB1 15.42,75.69 v15.42,75.72 | XP1.AB1 15.34,5.69 v15.34,5.71
  pour Route3 (no thermals): 2.01,128.26 19.07,128.26 19.07,133.03 170.44,133.11 170.44,91.27 86.62,90.88 86.62,78.02 86.38,50.87 86.38,41.03 129.72,41.11 129.72,90.32 170.04,90.16 170.04,0.79 16.93,0.87 16.93,4.6 3.2,4.6 3.2,57.54 19.15,57.54 19.15,74.21 2.01,74.21
/DREADY  (via drill 0.2)
  Top 0.203: v72.74,97.04 72.74,101.81 IC16.17 | v64.49,70.61 v64.49,97.04 | v76.27,70.61 77.09,69.79 77.09,68.99 RN2.8
  Bottom 0.203: v64.49,97.04 v72.74,97.04 | v76.27,70.61 v64.49,70.61 | IC1.56 80.89,66.44 78.37,68.96 77.12,68.96 RN2.8
/FD  (via drill 0.2)
  Top 0.203: v65.12,74.06 65.12,94.46 65.49,94.84 65.49,101.56 65.74,101.81 IC16.10 | IC1.58 80.89,71.51 78.37,74.04 77.12,74.04 RN2.6
  Bottom 0.203: v65.12,74.06 RN2.6
/FL  (via drill 0.2)
  Top 0.203: v67.62,71.51 67.62,83.76 67.14,84.24 67.14,101.44 66.77,101.81 IC16.11
  Bottom 0.203: v67.62,71.51 RN2.7 77.12,71.41 77.59,71.41 79.14,69.86 80.02,69.86 80.89,68.99 IC1.57
/FPPRD  (via drill 0.2)
  Top 0.203: v70.77,95.06 70.77,101.81 IC16.15 | v75.44,95.06 75.44,65.56 77.09,63.91 RN2.10
  Bottom 0.203: v75.44,95.06 v70.77,95.06 | IC1.54 80.89,61.36 79.82,62.44 78.57,62.44 77.12,63.89 RN2.10
/FPPTR  (via drill 0.2)
  Top 0.203: v69.77,58.19 69.77,101.81 IC16.14
  Bottom 0.203: v69.77,58.19 77.09,58.19 RN3.2 77.12,58.29 77.27,58.44 80.54,58.44 80.89,58.79 IC1.53
/LIN  (via drill 0.2)
  Top 0.203: v67.77,91.89 67.77,101.81 IC16.12 | v79.87,91.89 79.87,80.16 80.89,79.14 IC1.61
  Bottom 0.203: v79.87,91.89 v67.77,91.89 | RN2.4 77.12,79.14 80.89,79.14 IC1.61
/RX  (via drill 0.2)
  Top 0.203: v126.12,5.84 126.12,10.49 125.89,10.71 125.89,11.14 123.84,11.14 IC19.109 | v165.04,5.84 165.04,56.34 164.84,56.54 164.84,93.36 164.09,94.11 164.09,95.41 v164.24,95.56
  Bottom 0.203: v126.12,5.84 126.19,5.91 152.44,5.91 152.52,5.84 v165.04,5.84 | v164.24,95.56 158.79,95.56 158.47,95.24 141.32,95.24 140.29,96.26 IC2.28
/TX  (via drill 0.2)
  Top 0.203: v126.74,8.34 126.74,10.86 125.99,11.61 125.99,12.14 123.84,12.14 IC19.111 | v163.37,8.34 163.37,19.14 163.17,19.34 163.17,26.91 163.37,27.11 163.37,55.76 v163.17,55.96 | v142.22,55.96 142.22,68.51 141.79,68.94 141.79,93.31 139.02,96.09 IC2.27
  Bottom 0.203: v163.37,8.34 v126.74,8.34 | v142.22,55.96 v163.17,55.96
ACLO  (via drill 0.2)
  Top 0.203: v126.12,19.99 126.12,13.16 123.84,13.16 IC19.113 | v34.09,39.51 34.09,55.19 34.22,55.31 34.22,56.41 35.09,57.29 DD6.10 | v82.14,20.31 81.52,19.69 79.14,19.69 79.14,24.71 76.79,27.06 75.62,27.06 v75.62,39.46
  Bottom 0.203: RN6.10 132.34,20.14 132.19,19.99 v126.12,19.99 126.09,19.89 119.77,19.89 118.89,19.01 107.44,19.01 107.39,19.06 98.94,19.06 98.57,18.69 96.72,18.69 95.09,20.31 v82.14,20.31 | 75.62,39.51 76.54,39.51 76.69,39.36 78.47,39.36 80.12,41.01 80.89,41.01 IC1.46 | 75.62,39.51 v34.09,39.51 | v75.62,39.46 75.62,39.51
ACLO_F  (via drill 0.2)
  Top 0.203: v122.72,22.56 122.72,23.14 123.82,23.14 IC19.133 | v131.12,22.54 131.32,22.74 131.32,23.11 132.42,24.21 134.67,24.21 134.67,42.76 133.44,43.99 v133.44,50.04 | v141.39,50.04 141.39,60.59 141.79,60.99 141.79,67.76 140.77,68.79 IC4.9
  Bottom 0.203: v122.72,22.56 131.09,22.56 v131.12,22.54 | v141.39,50.04 v133.44,50.04
ACLO_P  (via drill 0.2)
  Top 0.203: v124.94,17.34 124.89,17.34 124.59,17.64 123.84,17.64 IC19.122 | v147.89,17.54 147.89,24.89 148.92,25.91 148.92,38.04 | 148.92,38.04 147.92,39.04 IC17.2 | v160.94,118.71 160.94,122.29 R5.1 | v168.97,118.71 168.97,97.41 168.09,96.54 168.09,90.99 168.17,90.91 v168.17,53.26 | v149.89,53.26 149.89,38.94 149.02,38.06 148.92,38.04
  Bottom 0.203: v124.94,17.34 125.14,17.54 125.44,17.54 125.64,17.74 136.42,17.74 136.62,17.54 v147.89,17.54 | v168.97,118.71 v160.94,118.71 | v149.89,53.26 v168.17,53.26
AD0  (via drill 0.2)
  Top 0.203: v93.54,36.01 94.14,35.41 94.14,32.16 93.24,32.16 IC19.6 | v87.04,36.31 87.04,51.54 86.84,51.74 86.84,55.26 87.89,56.31 v87.89,62.86 | v36.14,63.89 36.14,76.59 DD1.10 | 90.69,77.34 90.69,90.71 91.47,91.49 91.47,98.49 90.44,99.51 IC6.11 | 90.69,77.34 90.69,76.91 91.79,76.91 IC9.9 | v64.77,119.41 64.77,121.31 IC16.56 | v88.77,119.41 88.92,119.26 88.92,103.04 | 88.92,103.04 88.92,99.69 v88.77,99.54 | 115.5,101.1 IC3.16 | 115.5,101.1 114.97,100.56 114.97,77.11 114.54,76.69 IC7.9 | v147.89,105.64 147.89,119.11 IC2.9 | v115.44,105.49 115.44,101.16 115.5,101.1 | v88.77,103.04 88.92,103.04 | v71.67,77.61 v71.67,64.79 | v90.67,77.34 90.69,77.34
  Bottom 0.203: v93.54,36.01 93.34,36.21 87.14,36.21 v87.04,36.31 | v87.89,62.86 79.57,62.86 77.52,64.91 71.67,64.91 | 71.67,64.91 62.54,64.91 61.54,63.91 RN19.7 61.44,63.89 58.07,63.89 IC1.10 57.97,63.89 v36.14,63.89 | v88.77,119.41 v64.77,119.41 | v88.77,99.54 90.42,99.54 IC6.11 | v147.89,105.64 119.29,105.64 119.04,105.39 117.14,105.39 116.89,105.64 115.59,105.64 v115.44,105.49 | v88.77,103.04 88.82,103.09 109.99,103.09 110.12,102.96 110.84,102.96 110.97,103.09 115.47,103.09 116.47,102.09 IC3.16 | v71.67,77.61 89.04,77.61 89.32,77.34 v90.67,77.34 | v71.67,64.79 71.67,64.91
AD1  (via drill 0.2)
  Top 0.203: v62.77,120.16 IC16.57 | v89.19,120.16 89.39,119.96 89.39,98.04 89.45,97.97 | 89.45,97.97 90.42,97.01 IC6.12 | v43.77,61.41 43.77,76.59 42.74,77.61 DD1.13 | v93.14,78.46 93.14,76.11 92.27,76.11 92.04,75.89 IC9.10 | v110.04,78.26 110.24,78.06 110.24,76.31 110.67,75.89 111.14,75.89 IC7.10 111.24,75.94 114.37,75.94 115.39,76.96 115.39,98.44 116.47,99.51 IC3.15 116.57,99.56 116.57,100.49 118.17,102.09 118.17,118.14 v118.39,118.36 | v93.97,47.99 94.17,47.79 94.17,36.14 94.57,35.74 94.57,31.66 93.24,31.66 IC19.7 | v95.64,47.99 95.44,48.19 95.44,55.89 95.82,56.26 95.82,60.39 95.68,60.53 | 95.68,60.53 95.42,60.79 95.42,71.79 95.79,72.16 v95.79,78.36 | v95.62,60.31 95.62,60.46 95.68,60.53 | v89.39,79.06 89.39,97.91 89.45,97.97
  Bottom 0.203: v89.19,120.16 v62.77,120.16 | v43.77,61.41 57.97,61.41 IC1.11 58.07,61.36 61.52,61.36 RN19.8 61.54,61.46 61.82,61.74 79.07,61.74 80.49,60.31 v95.62,60.31 | 95.79,78.46 101.42,78.46 101.62,78.66 109.59,78.66 109.99,78.26 v110.04,78.26 | 95.79,78.46 v93.14,78.46 93.12,78.56 92.82,78.86 89.59,78.86 v89.39,79.06 | v95.64,47.99 v93.97,47.99 | v95.79,78.36 95.79,78.46 | IC2.10 145.12,120.16 128.39,120.16 126.99,118.76 119.97,118.76 119.57,118.36 v118.39,118.36
AD2  (via drill 0.2)
  Top 0.203: 88.77,73.71 90.92,73.71 | 90.92,73.71 91.79,73.71 IC9.13 | 88.77,83.19 v88.77,94.44 88.67,94.46 88.67,97.89 88.14,98.41 88.14,103.29 88.29,103.44 v88.29,117.04 | 88.77,83.19 88.77,73.71 | v94.97,29.14 94.97,31.14 93.24,31.14 IC19.8 | v86.42,28.74 86.42,38.34 86.62,38.54 86.62,51.39 86.42,51.59 86.42,55.41 87.27,56.26 87.27,72.29 88.67,73.69 88.77,73.71 | v110.04,73.44 110.04,73.46 111.14,73.46 IC7.13 | v90.92,73.64 90.92,73.71 | v64.27,117.04 64.27,117.96 63.12,117.96 62.77,118.31 IC16.58 | v88.67,83.19 88.77,83.19 | v145.59,97.71 145.59,99.24 145.74,99.39 145.74,118.74 145.37,119.11 IC2.11 | v55.94,83.09 v55.94,58.91
  Bottom 0.203: RN19.9 61.52,58.81 58.07,58.81 IC1.12 58.04,58.91 v55.94,58.91 | v88.77,94.44 90.42,94.44 IC6.13 90.49,94.54 91.92,95.96 111.82,95.96 112.19,96.34 115.82,96.34 IC3.14 116.49,97.09 117.42,98.01 127.04,98.01 127.27,97.79 145.52,97.79 v145.59,97.71 | v94.97,29.14 94.57,28.74 v86.42,28.74 | v110.04,73.44 106.97,73.44 106.37,74.04 94.19,74.04 93.67,73.51 91.04,73.51 v90.92,73.64 | v88.29,117.04 v64.27,117.04 | v88.67,83.19 55.94,83.19 | 55.94,83.19 47.34,83.19 45.29,85.24 DD1.3 | v55.94,83.09 55.94,83.19
AD3  (via drill 0.2)
  Top 0.203: v121.07,94.49 v121.07,123.84 | v61.24,117.24 62.67,117.24 62.74,117.31 IC16.59 | v38.62,117.39 38.67,117.34 38.67,86.26 38.6,86.2 | 38.6,86.2 37.67,85.26 DD1.6 | v93.14,71.14 93.14,72.46 92.24,72.46 92.04,72.66 IC9.14 91.94,72.64 91.49,72.64 88.52,69.66 88.52,55.24 | v110.04,71.26 110.24,71.46 110.24,72.26 | 110.24,72.26 110.64,72.66 111.14,72.66 IC7.14 | v92.12,31.59 92.27,31.44 92.27,30.66 IC19.9 | 88.52,55.24 v88.52,31.59 | v88.32,55.24 88.52,55.24 | v38.67,56.41 38.67,75.51 38.54,75.64 38.54,76.79 38.67,76.91 38.67,86.14 38.6,86.2 | v108.24,92.79 108.24,73.89 109.84,72.29 110.14,72.29 110.24,72.26
  Bottom 0.203: 108.24,92.99 113.34,92.99 114.79,94.44 116.47,94.44 IC3.13 116.57,94.49 v121.07,94.49 | 108.24,92.99 106.77,92.99 105.69,91.91 IC6.15 | v121.07,123.84 141.92,123.84 144.07,121.69 IC2.12 | v61.24,117.24 38.77,117.24 v38.62,117.39 | v93.14,71.14 93.27,71.26 107.07,71.26 107.09,71.24 110.02,71.24 v110.04,71.26 | v88.52,31.59 v92.12,31.59 | v88.32,55.24 80.49,55.24 79.07,56.66 61.82,56.66 61.54,56.39 RN19.10 61.52,56.29 58.07,56.29 IC1.13 57.97,56.26 38.82,56.26 v38.67,56.41 | v108.24,92.79 108.24,92.99
AD4  (via drill 0.2)
  Top 0.203: v94.34,29.99 94.34,30.14 93.24,30.14 IC19.10 | v79.37,29.91 79.17,30.11 79.17,35.59 79.39,35.81 79.39,49.29 79.19,49.49 v79.19,53.56 79.29,53.59 79.42,53.71 79.42,55.09 79.57,55.24 v79.57,70.49 | v102.17,72.59 103.19,72.59 103.27,72.66 IC9.31 | v123.54,72.69 IC7.31 | v64.27,115.79 64.27,115.96 63.12,115.96 62.77,116.31 IC16.60 | v36.14,113.24 36.14,98.99 35.12,97.96 DD2.10 | 100.2,113.75 IC3.4 | 100.2,113.75 99.57,113.11 v99.57,95.34 99.47,95.31 98.99,94.84 v98.99,72.16 | v142.82,120.79 IC2.13 | v100.14,121.31 100.14,113.81 100.2,113.75
  Bottom 0.203: v94.34,29.99 81.47,29.99 81.32,29.84 79.44,29.84 v79.37,29.91 | v79.19,53.56 78.64,54.11 64.47,54.11 64.09,53.74 RN18.10 63.99,53.74 58.07,53.74 IC1.14 | v123.54,72.69 121.14,72.69 120.94,72.49 105.74,72.49 105.64,72.59 v102.17,72.59 102.14,72.49 101.82,72.16 v98.99,72.16 98.97,72.06 98.67,71.76 84.79,71.76 83.52,70.49 v79.57,70.49 | IC3.4 101.22,114.79 100.22,115.79 v64.27,115.79 64.24,115.69 61.69,115.69 59.44,113.44 36.34,113.44 v36.14,113.24 | v99.57,95.34 99.72,95.49 104.64,95.49 IC6.16 | v142.82,120.79 142.67,120.64 127.29,120.64 126.84,121.09 117.19,121.09 117.04,120.94 106.62,120.94 106.24,121.31 v100.14,121.31
AD5  (via drill 0.2)
  Top 0.203: v91.14,32.21 91.32,32.04 91.32,31.51 91.84,30.99 91.84,29.66 IC19.11 | v65.19,32.76 65.12,32.84 65.12,50.16 64.09,51.19 RN18.9 | v104.39,71.96 104.39,73.26 103.49,73.26 103.29,73.46 IC9.32 | v121.29,71.96 121.49,72.16 121.49,73.06 121.89,73.46 122.39,73.46 IC7.32 | v64.27,113.09 64.27,114.91 63.87,115.31 62.77,115.31 IC16.61 | 41.75,98.92 41.69,98.99 v41.69,112.56 | 41.75,98.92 42.72,97.96 DD2.13 | v141.54,113.26 IC2.14 | v107.34,113.26 107.34,111.26 v107.32,111.16 v107.32,97.01 107.34,96.91 v107.34,71.86 | v41.69,50.96 41.69,60.11 41.84,60.26 41.84,64.36 41.69,64.51 41.69,98.86 41.75,98.92
  Bottom 0.203: v91.14,32.21 81.59,32.21 81.42,32.39 65.57,32.39 v65.19,32.76 | RN18.9 58.07,51.19 IC1.15 58.04,51.09 57.92,50.96 v41.69,50.96 | v121.29,71.96 107.34,71.96 | 107.34,71.96 v104.39,71.96 | 100.22,111.21 89.99,111.21 88.12,113.09 v64.27,113.09 64.24,112.99 63.82,112.56 v41.69,112.56 | 100.22,111.21 101.22,112.21 IC3.5 | v107.32,97.01 105.69,97.01 IC6.17 | v107.32,111.16 100.29,111.16 100.22,111.21 | v107.34,113.26 v141.54,113.26 | v107.34,71.86 107.34,71.96
AD6  (via drill 0.2)
  Top 0.203: v89.14,47.61 89.14,47.19 90.64,45.69 90.64,39.59 90.49,39.44 90.49,31.99 90.89,31.59 90.89,31.36 91.42,30.84 91.42,29.16 IC19.12 | v59.67,103.91 59.67,114.11 62.54,114.11 62.74,114.31 IC16.62 | v45.29,103.91 45.29,105.56 DD2.3 | 105.04,76.11 105.24,76.11 105.24,76.99 106.69,78.44 106.69,98.51 105.69,99.51 IC6.18 | 105.04,76.11 103.52,76.11 IC9.35 | v121.29,76.06 122.22,76.06 122.39,75.89 IC7.35 | 105.04,76.11 v105.04,75.81 | v100.19,100.56 100.19,108.66 IC3.6 | v129.29,100.56 v129.29,117.69 | v83.42,47.71 83.22,47.91 83.22,63.46 83.07,63.61 83.07,73.04 v85.39,75.36
  Bottom 0.203: 83.42,47.61 79.97,47.61 78.54,49.04 64.47,49.04 RN18.8 63.99,48.66 58.07,48.66 IC1.16 | 83.42,47.61 v89.14,47.61 | v45.29,103.91 v59.67,103.91 59.69,103.81 60.02,103.49 83.94,103.49 86.44,100.99 99.84,100.99 100.17,100.66 v100.19,100.56 104.64,100.56 104.7,100.5 | v121.29,76.06 121.09,75.86 106.42,75.86 106.37,75.81 v105.04,75.81 104.97,75.86 101.57,75.86 101.27,75.56 85.59,75.56 v85.39,75.36 | 104.7,100.5 IC6.18 | v129.29,117.69 138.84,117.69 140.27,119.11 IC2.15 | v129.29,100.56 104.77,100.56 104.7,100.5 | v83.42,47.71 83.42,47.61
AD7  (via drill 0.2)
  Top 0.203: v90.02,45.09 90.22,44.89 90.22,39.74 90.07,39.59 90.07,31.61 90.99,30.69 90.99,28.74 92.22,28.74 92.29,28.66 IC19.13 | v60.29,104.54 60.19,104.64 60.19,111.96 62.39,111.96 62.74,112.31 IC16.64 | 104.64,101.04 104.64,77.36 | 104.64,77.36 104.64,76.91 103.52,76.91 IC9.36 | 104.64,101.04 IC6.19 | v121.29,76.94 121.29,76.91 122.17,76.91 122.39,76.69 IC7.36 | v104.74,77.36 104.64,77.36 | 102.2,106.17 104.54,103.84 104.54,101.06 104.64,101.04 | 102.2,106.17 101.24,107.14 IC3.7 | v102.27,124.04 102.27,106.24 102.2,106.17 | v84.04,45.19 84.04,49.24 83.64,49.64 83.64,63.61 83.49,63.76 83.49,72.59 86.99,76.09 v86.99,76.71
  Bottom 0.203: 84.04,45.09 78.94,45.09 77.52,46.51 64.49,46.51 64.09,46.11 RN18.7 63.99,46.11 58.07,46.11 IC1.17 | 84.04,45.09 v90.02,45.09 | DD2.6 37.67,105.56 38.69,104.54 v60.29,104.54 60.32,104.64 60.74,105.06 85.27,105.06 85.39,104.94 89.32,104.94 90.49,106.11 100.19,106.11 101.22,107.14 IC3.7 | v121.29,76.94 106.82,76.94 106.39,77.36 v104.74,77.36 104.72,77.26 104.17,76.71 v86.99,76.71 | v102.27,124.04 102.39,123.91 116.39,123.91 117.09,123.21 121.32,123.21 121.52,123.41 137.27,123.41 138.99,121.69 IC2.16 | v84.04,45.19 84.04,45.09
AD8  (via drill 0.2)
  Top 0.203: v93.14,56.51 93.14,55.41 92.27,55.41 92.04,55.19 IC10.9 | v112.27,56.71 112.07,56.51 112.07,55.59 111.67,55.19 111.17,55.19 IC8.9 | v92.02,28.11 92.02,27.66 IC19.15 | v89.14,28.11 89.14,39.56 88.97,39.74 88.97,42.46 v89.14,42.64 | v95.19,56.51 95.02,56.34 95.02,42.86 v95.22,42.66 | v61.24,110.79 61.24,110.96 62.39,110.96 62.74,111.31 IC16.1 | v35.12,110.79 DD3.10 | v110.37,103.59 110.37,100.54 111.37,99.54 IC5.11 | v137.74,103.59 137.74,119.11 IC2.17 | v84.59,110.69 84.64,110.64 v84.64,103.66 84.62,103.56 v84.62,97.31 | v73.94,44.46 74.14,44.66 74.14,83.91 74.19,83.96 v74.19,96.74
  Bottom 0.203: v93.14,56.51 93.34,56.71 95.19,56.71 | 95.19,56.71 104.64,56.71 104.84,56.51 112.07,56.51 v112.27,56.71 | v89.14,28.11 v92.02,28.11 | 73.94,44.39 64.89,44.39 64.09,43.59 RN18.6 63.99,43.59 58.07,43.59 IC1.18 | 73.94,44.39 77.09,44.39 78.94,42.54 81.32,42.54 81.42,42.64 v89.14,42.64 89.24,42.66 v95.22,42.66 | v95.19,56.51 95.19,56.71 | v35.12,110.79 v61.24,110.79 61.27,110.69 v84.59,110.69 | 102.18,103.65 102.24,103.59 v110.37,103.59 v137.74,103.59 | 102.18,103.65 101.24,104.59 IC3.8 | v84.64,103.66 89.94,103.66 90.02,103.59 102.12,103.59 102.18,103.65 | v74.19,96.74 79.92,96.74 80.49,97.31 v84.62,97.31 | v73.94,44.46 73.94,44.39
AD9  (via drill 0.2)
  Top 0.203: v93.14,54.54 92.19,54.54 92.04,54.39 IC10.10 | v110.04,55.29 110.24,55.09 110.24,54.79 110.64,54.39 111.14,54.39 IC8.10 | v94.34,27.49 94.34,27.16 93.24,27.16 IC19.16 | v87.89,27.49 87.89,35.14 88.09,35.34 88.09,53.39 v87.89,53.59 | v78.77,41.29 78.94,41.11 78.94,35.94 78.74,35.74 v78.74,27.49 | v60.82,107.06 60.82,109.49 61.64,110.31 62.74,110.31 IC16.2 | v102.27,98.01 102.27,101.04 101.24,102.06 IC3.9 | v134.39,100.04 136.22,101.86 136.22,121.41 IC2.18 | v87.04,98.64 v87.04,106.99 | v74.37,41.44 74.57,41.64 74.57,83.76 74.82,84.01 v74.82,97.36
  Bottom 0.203: IC1.19 58.07,41.04 RN18.5 64.09,41.14 64.37,41.41 74.37,41.41 | v110.04,55.29 108.62,55.29 107.87,54.54 v93.14,54.54 93.12,54.44 92.27,53.59 v87.89,53.59 | v94.34,27.49 v87.89,27.49 87.87,27.39 87.79,27.31 78.92,27.31 v78.74,27.49 | 74.37,41.41 78.64,41.41 v78.77,41.29 | DD3.13 42.74,108.09 43.77,107.06 v60.82,107.06 60.87,106.99 v87.04,106.99 | 110.18,97.83 110.99,97.01 111.37,97.01 IC5.12 | 110.18,97.83 109.99,98.01 v102.27,98.01 102.24,98.11 101.92,98.44 90.07,98.44 89.87,98.64 v87.04,98.64 87.02,98.54 84.97,98.54 84.24,97.81 75.27,97.81 v74.82,97.36 | v134.39,100.04 134.19,99.84 128.39,99.84 126.99,98.44 111.17,98.44 110.62,97.89 110.24,97.89 110.18,97.83 | v74.37,41.44 74.37,41.41
AD10  (via drill 0.2)
  Top 0.203: v93.14,51.81 92.19,51.81 92.04,51.96 IC10.13 | v110.04,52.51 110.57,51.99 111.14,51.99 IC8.13 | v95.97,35.59 95.97,26.66 93.24,26.66 IC19.17 | v87.47,51.99 87.67,51.79 87.67,35.79 v87.47,35.59 | 60.75,104.13 59.92,103.29 59.04,103.29 v59.04,114.69 | 60.75,104.13 60.92,104.29 60.92,105.84 61.44,106.36 61.44,108.96 62.39,108.96 62.74,109.31 IC16.3 | IC5.13 111.37,94.46 110.37,95.46 v110.37,98.51 110.27,98.54 109.74,99.06 109.74,118.09 v109.99,118.34 | 60.75,104.13 60.82,104.06 v60.82,100.94 60.92,100.91 63.19,98.64 63.19,72.24 63.04,72.09 63.04,39.54 64.07,38.51 RN18.4
  Bottom 0.203: v110.04,52.51 105.34,52.51 104.84,52.01 93.34,52.01 v93.14,51.81 93.19,51.99 v87.47,51.99 | v95.97,35.59 95.77,35.39 87.47,35.39 | 87.47,35.39 82.92,35.39 81.32,36.99 77.67,36.99 77.52,36.84 65.74,36.84 64.09,38.49 RN18.4 63.99,38.49 58.07,38.49 IC1.20 | v87.47,35.59 87.47,35.39 | v59.04,114.69 46.32,114.69 45.29,115.71 DD3.3 | v110.37,98.51 102.64,98.51 101.64,99.51 101.24,99.51 IC3.10 101.19,99.61 100.27,99.61 99.32,100.56 86.29,100.56 85.92,100.94 v60.82,100.94 | v109.99,118.34 116.89,118.34 117.49,117.74 119.52,117.74 120.12,118.34 129.52,118.34 129.74,118.11 134.19,118.11 135.19,119.11 IC2.19
AD11  (via drill 0.2)
  Top 0.203: v94.34,25.26 94.34,26.14 93.24,26.14 IC19.18 | v81.99,25.14 81.94,25.19 81.94,28.74 80.84,29.84 79.99,29.84 79.99,30.34 79.79,30.54 v79.79,35.34 79.82,35.44 v79.82,49.74 | v90.92,49.74 90.92,50.94 91.79,50.94 IC10.14 | v106.79,43.16 106.79,42.54 107.87,42.54 108.87,43.54 108.87,47.39 109.69,48.21 109.69,50.94 110.92,50.94 111.14,51.16 IC8.14 | v98.92,42.96 99.12,43.16 99.12,44.56 99.34,44.79 v99.34,50.24 | v64.27,111.94 64.27,109.11 63.87,108.71 63.14,108.71 IC16.4 | v37.67,111.94 37.67,115.71 DD3.6 | v102.27,90.41 102.27,95.96 101.24,96.99 IC3.11 | IC2.20 133.69,121.44 133.69,100.04 131.64,97.99 v131.64,91.99 | v87.67,112.06 v87.67,98.01 87.62,97.94 87.62,76.14 83.92,72.44 83.92,63.91 84.07,63.76 84.07,50.09 v84.27,49.89
  Bottom 0.203: v94.34,25.26 94.22,25.14 v81.99,25.14 | v79.79,35.34 64.69,35.34 64.09,35.94 RN18.3 63.99,35.96 58.07,35.96 IC1.21 | v79.82,49.74 84.27,49.74 | 84.27,49.74 v90.92,49.74 90.94,49.84 91.34,50.24 v99.34,50.24 | v106.79,43.16 106.59,42.96 101.67,42.96 101.47,43.16 100.62,43.16 100.42,42.96 v98.92,42.96 | v37.67,111.94 v64.27,111.94 64.29,111.84 64.59,111.54 84.87,111.54 85.39,112.06 v87.67,112.06 | v102.27,90.41 102.32,90.46 125.19,90.46 126.62,91.89 IC5.15 126.69,91.99 v131.64,91.99 | v87.67,98.01 100.22,98.01 101.22,97.01 IC3.11 | v84.27,49.89 84.27,49.74
AD12  (via drill 0.2)
  Top 0.203: v104.39,50.26 104.39,50.94 103.52,50.94 IC10.31 | v121.29,50.26 121.49,50.46 121.49,50.74 121.92,51.16 122.39,51.16 IC8.31 122.52,51.19 122.74,51.41 123.54,51.41 v123.54,52.06 | v124.97,104.59 125.17,104.39 125.17,95.91 125.65,95.42 | 125.65,95.42 IC5.16 | v123.69,53.49 123.92,53.71 123.92,58.36 124.17,58.61 124.17,71.76 v123.97,71.96 | v127.24,73.09 127.04,73.29 127.04,77.19 125.59,78.64 125.59,95.36 125.65,95.42 | v64.27,108.24 64.27,107.71 63.14,107.71 IC16.5 | v36.77,109.61 36.77,115.16 36.14,115.79 36.14,117.24 DD4.10 | v92.12,26.86 92.12,25.66 IC19.19 | v65.17,26.86 65.12,26.91 65.12,31.96 64.09,32.99 64.09,33.39 RN18.2 | 55.32,93.49 55.32,49.26 55.42,49.16 v55.42,33.46 | 55.32,93.49 v55.32,109.51 | v55.42,93.49 55.32,93.49
  Bottom 0.203: v121.29,50.26 v104.39,50.26 | 127.45,95.27 128.44,96.26 132.64,96.26 IC2.22 | 127.45,95.27 126.64,94.46 IC5.16 | v124.97,104.59 116.49,104.59 IC3.17 | v123.54,52.06 123.69,52.21 v123.69,53.49 | v123.97,71.96 124.42,72.41 126.57,72.41 v127.24,73.09 | v64.27,108.24 62.89,109.61 55.32,109.61 | v36.77,109.61 55.32,109.61 | v65.17,26.86 v92.12,26.86 | RN18.2 64.07,33.39 63.07,32.39 59.07,32.39 58.07,33.39 IC1.22 57.97,33.46 v55.42,33.46 | v55.32,109.51 55.32,109.61 | v55.42,93.49 84.49,93.49 84.57,93.41 111.79,93.41 113.87,95.49 116.87,95.49 117.02,95.34 127.39,95.34 127.45,95.27
AD13  (via drill 0.2)
  Top 0.203: v105.22,49.21 105.22,50.31 104.89,50.64 104.89,51.74 103.52,51.74 IC10.32 | v120.59,49.21 120.67,49.29 120.67,50.71 121.92,51.96 122.39,51.96 IC8.32 | IC19.20 90.57,25.16 90.57,30.24 v89.84,30.96 89.74,30.99 89.64,31.09 89.64,39.94 v89.59,39.99 | v96.89,39.99 v96.89,48.81 | v125.39,107.14 125.59,106.94 125.59,98.04 126.62,97.01 IC5.17 | v61.44,102.86 61.44,105.76 61.62,105.94 61.62,105.96 62.39,105.96 62.74,106.31 IC16.6 | v43.77,102.86 43.77,117.24 43.7,117.3 | 43.7,117.3 42.74,118.26 DD4.13 | v115.44,127.64 115.44,108.19 IC3.18 | v43.77,127.64 43.77,117.36 43.7,117.3 | v53.47,30.99 53.34,31.11 53.34,72.94 53.22,73.06 v53.22,102.76
  Bottom 0.203: v120.59,49.21 120.39,49.41 105.42,49.41 v105.22,49.21 105.19,49.11 104.89,48.81 v96.89,48.81 | v89.84,30.96 82.27,30.96 81.34,31.89 62.54,31.89 61.54,30.89 RN17.2 61.44,30.89 58.07,30.89 IC1.23 58.04,30.99 v53.47,30.99 | v89.59,39.99 v96.89,39.99 | v125.39,107.14 116.49,107.14 IC3.18 | v43.77,102.86 53.22,102.86 | 53.22,102.86 v61.44,102.86 | v43.77,127.64 v115.44,127.64 | v53.22,102.76 53.22,102.86
AD14  (via drill 0.2)
  Top 0.203: v104.39,53.76 104.39,54.14 103.52,54.14 IC10.35 | v121.29,54.54 121.44,54.39 122.39,54.39 IC8.35 | v89.94,29.36 89.94,24.66 IC19.21 | v78.57,50.46 77.64,49.54 76.24,49.54 v76.24,49.66 | v73.12,28.89 v73.12,49.66 | v127.67,108.66 127.67,100.56 126.64,99.54 IC5.18 | 64.27,105.71 64.89,105.71 64.89,118.41 64.14,119.16 v64.14,124.14 | 64.27,105.71 63.14,105.71 IC16.7 | v120.44,125.96 v120.44,108.76 | v57.02,105.69 57.02,78.11 57.97,78.11 59.07,77.01 59.07,29.34 58.07,28.34 IC1.24 | v64.27,105.69 64.27,105.71
  Bottom 0.203: v121.29,54.54 120.87,54.54 120.09,53.76 v104.39,53.76 104.37,53.66 103.52,52.81 94.42,52.81 93.69,53.54 92.79,53.54 91.87,52.61 83.77,52.61 81.32,50.16 80.27,50.16 79.97,50.46 v78.57,50.46 | v89.94,29.36 79.69,29.36 79.44,29.11 75.19,29.11 75.12,29.04 73.12,29.04 | 73.12,29.04 62.24,29.04 RN17.3 61.44,28.34 58.07,28.34 IC1.24 | v73.12,49.66 v76.24,49.66 | v73.12,28.89 73.12,29.04 | 120.44,108.66 117.52,108.66 116.49,109.69 IC3.19 | 120.44,108.66 v127.67,108.66 | DD4.3 45.29,125.86 47.02,124.14 v64.14,124.14 64.17,124.24 84.59,124.24 86.32,125.96 v120.44,125.96 | v120.44,108.76 120.44,108.66 | v64.27,105.69 v57.02,105.69
AD15  (via drill 0.2)
  Top 0.203: v104.39,56.09 104.39,55.41 103.52,55.41 103.29,55.19 IC10.36 | v121.29,56.09 121.49,55.89 121.49,55.61 121.92,55.19 122.39,55.19 IC8.36 | v94.34,24.44 94.34,24.16 93.24,24.16 IC19.22 | v89.57,57.79 v89.57,55.89 | v74.99,24.54 74.99,54.11 77.02,54.11 78.12,55.21 78.12,57.61 v78.32,57.81 78.12,57.74 v78.12,67.94 | v117.54,102.74 117.54,111.16 116.49,112.21 IC3.20 | v39.29,102.14 39.17,102.26 39.17,117.06 39.24,117.14 39.24,117.76 38.67,118.34 38.67,124.86 37.67,125.86 DD4.6 | IC16.8 62.74,104.31 v62.74,102.14 62.84,102.11 63.62,101.34 63.62,90.51 v63.82,90.31 63.84,90.21 v63.84,67.99 | v120.14,89.79 v120.14,102.06
  Bottom 0.203: v121.29,56.09 v104.39,56.09 104.37,55.99 104.27,55.89 v89.57,55.89 | 74.99,24.44 62.89,24.44 RN17.4 61.44,25.79 58.07,25.79 IC1.25 | 74.99,24.44 v94.34,24.44 | v89.57,57.79 78.34,57.79 v78.32,57.81 | v74.99,24.54 74.99,24.44 | IC2.25 136.47,98.84 134.12,101.19 127.52,101.19 126.64,102.06 IC5.19 126.59,102.16 120.14,102.16 | v117.54,102.74 118.12,102.16 120.14,102.16 | v39.29,102.14 v62.74,102.14 | v120.14,89.79 98.62,89.79 98.09,90.31 81.47,90.31 81.32,90.16 72.69,90.16 72.54,90.31 v63.82,90.31 | v120.14,102.06 120.14,102.16 | v78.12,67.94 73.82,67.94 73.77,67.99 v63.84,67.99
AD16  (via drill 0.2)
  Top 0.203: v96.77,2.54 96.77,6.59 IC19.55 | v64.64,1.99 64.24,2.39 64.24,20.54 61.54,23.24 RN17.5 | v34.22,58.96 34.09,59.09 34.09,66.46 35.09,67.46 DD8.10 | v52.22,58.96 52.42,58.76 52.42,23.46 v52.62,23.26
  Bottom 0.203: v96.77,2.54 96.74,2.56 93.14,2.56 92.14,1.56 65.07,1.56 v64.64,1.99 | v52.22,58.96 v34.22,58.96 | v52.62,23.26 IC1.26 58.14,23.26 61.52,23.26 RN17.5
AD17  (via drill 0.2)
  Top 0.203: v93.39,1.94 93.39,5.51 92.32,6.59 92.32,10.64 93.22,10.64 IC19.49 | v63.82,1.94 63.82,18.41 61.54,20.69 RN17.6 | v52.72,66.59 52.84,66.46 52.84,23.91 53.24,23.51 v53.24,20.71
  Bottom 0.203: v93.39,1.94 92.59,1.14 64.62,1.14 v63.82,1.94 | v52.72,66.59 51.34,66.59 51.19,66.44 43.77,66.44 42.74,67.46 DD8.13 | v53.24,20.71 IC1.27 58.14,20.71 61.52,20.71 RN17.6
AD18  (via drill 0.2)
  Top 0.203: v94.34,11.36 94.34,11.16 93.24,11.16 IC19.48 | v86.52,5.04 v86.52,11.36 | v63.19,5.04 62.99,5.24 62.99,16.71 RN17.7 61.44,18.19 60.52,19.11 60.52,74.24 v60.32,74.44
  Bottom 0.203: v86.52,11.36 v94.34,11.36 | v86.52,5.04 86.42,4.94 63.29,4.94 v63.19,5.04 | IC1.28 58.07,18.19 61.52,18.19 RN17.7 | v60.32,74.44 59.67,75.09 54.39,75.09 53.37,74.06 46.29,74.06 45.29,75.06 DD8.3
AD19  (via drill 0.2)
  Top 0.203: v91.99,4.59 91.99,6.34 91.89,6.44 91.89,11.64 93.22,11.64 IC19.47 | v62.57,4.49 62.57,14.59 61.54,15.61 RN17.8 | v37.67,72.46 37.67,75.06 DD8.6 | v59.69,72.39 59.49,72.19 59.49,17.06 58.07,15.64 IC1.29
  Bottom 0.203: v91.99,4.59 91.82,4.41 62.64,4.41 v62.57,4.49 | v37.67,72.46 57.54,72.46 57.62,72.54 59.54,72.54 v59.69,72.39 | RN17.8 61.52,15.64 58.07,15.64 IC1.29
AD20  (via drill 0.2)
  Top 0.203: v94.34,12.19 94.34,12.16 93.24,12.16 IC19.46 | v65.89,94.36 65.89,82.39 66.37,81.91 v66.37,13.99
  Bottom 0.203: v94.34,12.19 94.22,12.06 79.39,12.06 77.57,13.89 66.37,13.89 | 66.37,13.89 62.32,13.89 61.54,13.11 RN17.9 61.44,13.09 58.07,13.09 IC1.30 | v65.89,94.36 46.32,94.36 45.29,95.39 DD9.3 | v66.37,13.99 66.37,13.89
AD21  (via drill 0.2)  (1 unrouted)
  Top 0.203: v91.37,6.09 91.37,12.64 93.22,12.64 IC19.45 | v61.54,6.19 61.54,10.54 RN17.10 | v37.67,89.01 37.67,95.39 DD9.6 | v52.22,89.01 52.09,88.89 52.09,66.34 52.22,66.21 52.22,59.84 51.59,59.21 51.59,23.61 51.99,23.21 51.99,17.29 52.22,17.06 v52.22,10.56
  Bottom 0.203: v91.37,6.09 91.17,6.29 71.14,6.29 71.04,6.19 v61.54,6.19 | v52.22,89.01 v37.67,89.01 | v52.22,10.56 IC1.31 58.14,10.56 61.52,10.56 RN17.10
BAD0  (via drill 0.2)
  Top 0.203: v33.59,56.26 33.59,76.61 32.59,77.61 DD1.9
  Bottom 0.203: RN8.2 RN23.2 23.54,81.49 24.52,80.51 25.54,80.51 26.37,79.69 32.67,79.69 33.59,78.76 33.62,78.66 | 33.62,78.66 32.59,77.64 DD1.9 | 33.62,78.66 36.62,78.66 37.64,77.64 DD1.11 | v33.59,56.26 32.17,56.26 31.92,56.51 25.89,56.51 24.77,55.39 16.59,55.39 14.91,53.71 XP1.AB17
BAD1  (via drill 0.2)
  Top 0.203: v27.32,82.11 v27.32,59.04
  Bottom 0.203: RN8.3 RN23.3 23.54,84.04 24.32,83.26 25.32,83.26 26.37,82.21 27.32,82.21 | 41.22,78.66 40.19,77.64 DD1.12 | 41.22,78.66 44.24,78.66 45.27,77.64 DD1.14 | 27.32,82.21 37.74,82.21 41.19,78.76 41.22,78.66 | v27.32,59.04 25.72,59.04 24.17,57.49 8.94,57.49 8.17,56.71 XP1.AB18 | v27.32,82.11 27.32,82.21
BAD2
  Bottom 0.203: DD1.2 47.79,85.26 46.79,86.26 43.74,86.26 42.74,85.26 DD1.4 42.72,85.14 41.79,84.21 30.22,84.21 28.09,86.34 23.82,86.34 23.57,86.59 RN23.4 23.52,86.69 20.74,86.69 RN8.4 20.72,86.79 19.82,87.69 8.17,87.69 XP1.BB5
BAD3
  Bottom 0.203: 36.12,86.26 35.12,85.26 DD1.7 | 36.12,86.26 39.17,86.26 40.17,85.26 DD1.5 | XP1.BB6 15.07,90.69 16.15,89.61 20.42,89.61 20.72,89.31 RN8.5 RN23.5 23.54,89.11 25.89,86.76 35.69,86.76 36.09,86.36 36.12,86.26
BAD4  (via drill 0.2)
  Top 0.203: v19.64,93.71 19.64,98.84 20.64,99.84 RN5.2